# Altium project Power Distribution Board.PrjPcb (part 1 of 2)
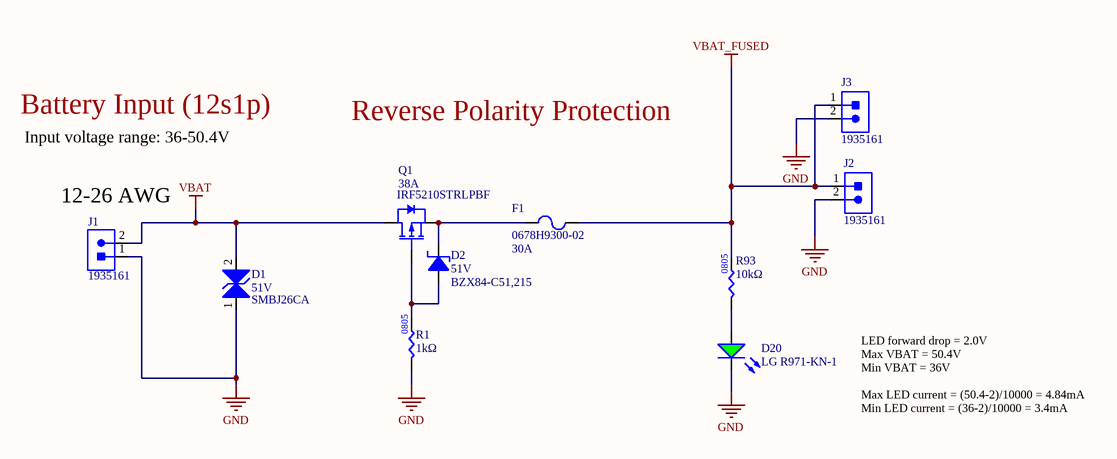
[diagram p0: SH1 - POWER.SchDoc]
9 sheets, 192 parts. Net scope: flat (ports and power ports of the same name join across sheets).
Board file: Power Distribution Board.PcbDoc
Sheets:
  SH1 - POWER.SchDoc
  SH2 - 17V BUCK CONVERTER.SchDoc
  SH3 - 5V BUCK CONVERTER.SchDoc
  SH4 - 3.3V LINEAR REGULATOR.SchDoc
  SH5 - LOAD MONITORING 1.SchDoc
  SH6 - LOAD MONITORING 2.SchDoc
  SH7 - MICROCONTROLLER.SchDoc
  SH8 - CAN.SchDoc
  SH9 - RS-485.SchDoc

## Sheet SH1 - POWER.SchDoc: Power
size B; Engineer: Farris Matar; Organization: UW Robotics; Address1: 200 University Avenue; Address2: Waterloo; Address3: Ontario; Address4: Canada N2L 3G6; DocumentNumber: 1; Revision: 3; SheetNumber: 1; SheetTotal: 9

### Parts
D1  Manufacturer Part Number 1: SMBJ26CA  Voltage - Reverse Standoff (Typ): 51V  [TVS_DIODE_BIDIR_SMB]  (hidden comment: TVS_DIODE_BIDIR_51V)
D2  Manufacturer Part Number 1: BZX84-C51,215  Working Voltage: 51V  [SOT23-3]  (hidden comment: DIO_ZENER_51V)
D20  Manufacturer Part Number 1: LG R971-KN-1  [LED_0805_GREEN]  (hidden comment: LED_GREEN)
F1  Manufacturer Part Number 1: 0678H9300-02  Current Rating: 30A  [FUSE_3912]  (hidden comment: FUSE_30A_3912)
J1  CON_2M_TERM  [1935161]  (value not drawn)
J2  CON_2M_TERM  [1935161]  (value not drawn)
J3  CON_2M_TERM  [1935161]  (value not drawn)
Q1  Current - Continous Drain: 38A  Manufacturer Part Number 1: IRF5210STRLPBF  [DPAK254P1524X483-4_3N - new]  (hidden comment: PMOS_100V_38A)
R1  value 1kΩ  [RES0805]  (hidden comment: RES_1kΩ_0805_1%)
R93  value 10kΩ  [RES0805]  (hidden comment: RES_10kΩ_0805_5%)

### Nets
GND: D1.1 D20.2(K) J1.1 J2.2 J3.2 R1.1
VBAT: D1.2 J1.2 Q1.2(Drain)
VBAT_FUSED: F1.2 J2.1 J3.1 R93.2
NetD2_1: D2.1(Anode) Q1.1(Gate) R1.2
NetD2_3: D2.3(Cathode) F1.1 Q1.3(Source)
NetD20_1: D20.1(A) R93.1

### Notes on the sheet
- Battery Input (12s1p)
- Input voltage range: 36-50.4V
- Reverse Polarity Protection
- (near J1) 12-26 AWG
- LED forward drop = 2.0V
  Max VBAT = 50.4V
  Min VBAT = 36V
  Max LED current = (50.4-2)/10000 = 4.84mA
  Min LED current = (36-2)/10000 = 3.4mA
- Title:
- Project:
- Date:
- Rev:
- Reviewer:
- Engineer:
- Sheet:
- of

### Library data of the parts
D1 = TVS_DIODE_BIDIR_51V: TVS DIODE 51VWM 82.4VC DO214AA; Manufacturer 1: Littelfuse; Package/Footprint: SMB; Voltage - Clamping (Max) @ Ipp: 82.4V; Voltage - Breakdown (Min): 56.7V; Mounting Type: SMD; Supplier 1: Digi-Key; Supplier Part Number 1: SMBJ51CALFCT-ND; Supplier 2: Digi-Key; Supplier Part Number 2: SMBJ51CA-FDIDKR-ND
D2 = DIO_ZENER_51V: DIODE ZENER 51V 250MW TO236AB; Manufacturer 1: Nexperia USA Inc.; Forward Voltage: 0.9V; Supplier Part Number 1: 1727-5037-1-ND; Supplier 1: Digi-Key; Package/Case: SOT-23-3
D20 = LED_GREEN: LED GREEN DIFFUSED 0805 SMD; Manufacturer 1: OSRAM; Forward Voltage Drop: 2.2V; Package/Footprint: 0805; Mounting Type: SMD; Supplier 1: Digi-Key; Supplier Part Number 1: 475-1410-1-ND; Supplier 2: Future Electronics; Supplier Part Number 2: 1152237
F1 = FUSE_30A_3912: FUSE SMT 3912 ENH BRK 250V 30A; Manufacturer 1: Bel Fuse Inc.; Package/Footprint: 3912; Supplier 1: Digi-Key; Supplier Part Number 1: 507-2254-1-ND; Mounting Type: SMD; Verified: No
J1-J3 = CON_2M_TERM: TERM BLK 2POS SIDE ENTRY 5MM; Manufacturer 1: Phoenix Contact; Voltage: 300V; Current: 18A; Max Current Rating: 16A; Package/Footprint: SMD; Supplier 1: Digi-Key; Manufacturer Part Number 1: 1935161; Supplier Part Number 1: 277-1667-ND; Mounting Type: TH
Q1 = PMOS_100V_38A: MOSFET P-CH 100V 38A D2PAK; Manufacturer 1: Vishay Siliconix; Vgs (Max): ±15V; Id: 120A; Mounting Type: SMD; Verified: No; Vdss: 100V; Supplier 1: Digi-Key; Supplier Part Number 1: IRF5210STRLPBFCT-ND; Package/Footprint: D2Pak
R1 = RES_1kΩ_0805_1%: RES 1K OHM 1% 1/8W 0805; Manufacturer 1: Yageo; Manufacturer Part Number 1: RC0805FR-071KL; Package: 0805; Supplier Part Number 1: 311-1.00KCRCT-ND; Supplier 1: Digi-Key; Mounting Type: SMD; LCSC Part #: C17513
R93 = RES_10kΩ_0805_5%: RES 10K OHM 5% 1/8W 0805; Manufacturer 1: Panasonic Electronic Components; Manufacturer Part Number 1: ERJ-6GEYJ103V; Package/Footprint: 0805; Supplier Part Number 1: P10KACT-ND; Supplier 1: Digi-Key; LCSC Part #: C17414; Mounting Type: SMD

## Sheet SH2 - 17V BUCK CONVERTER.SchDoc: 17V Buck Converter
size B; Engineer: Rishith Bomman; Organization: UW Robotics; Address1: 200 University Avenue; Address2: Waterloo; Address3: Ontario; Address4: Canada N2L 3G6; DocumentNumber: 2; Revision: 3; SheetNumber: 2; SheetTotal: 9
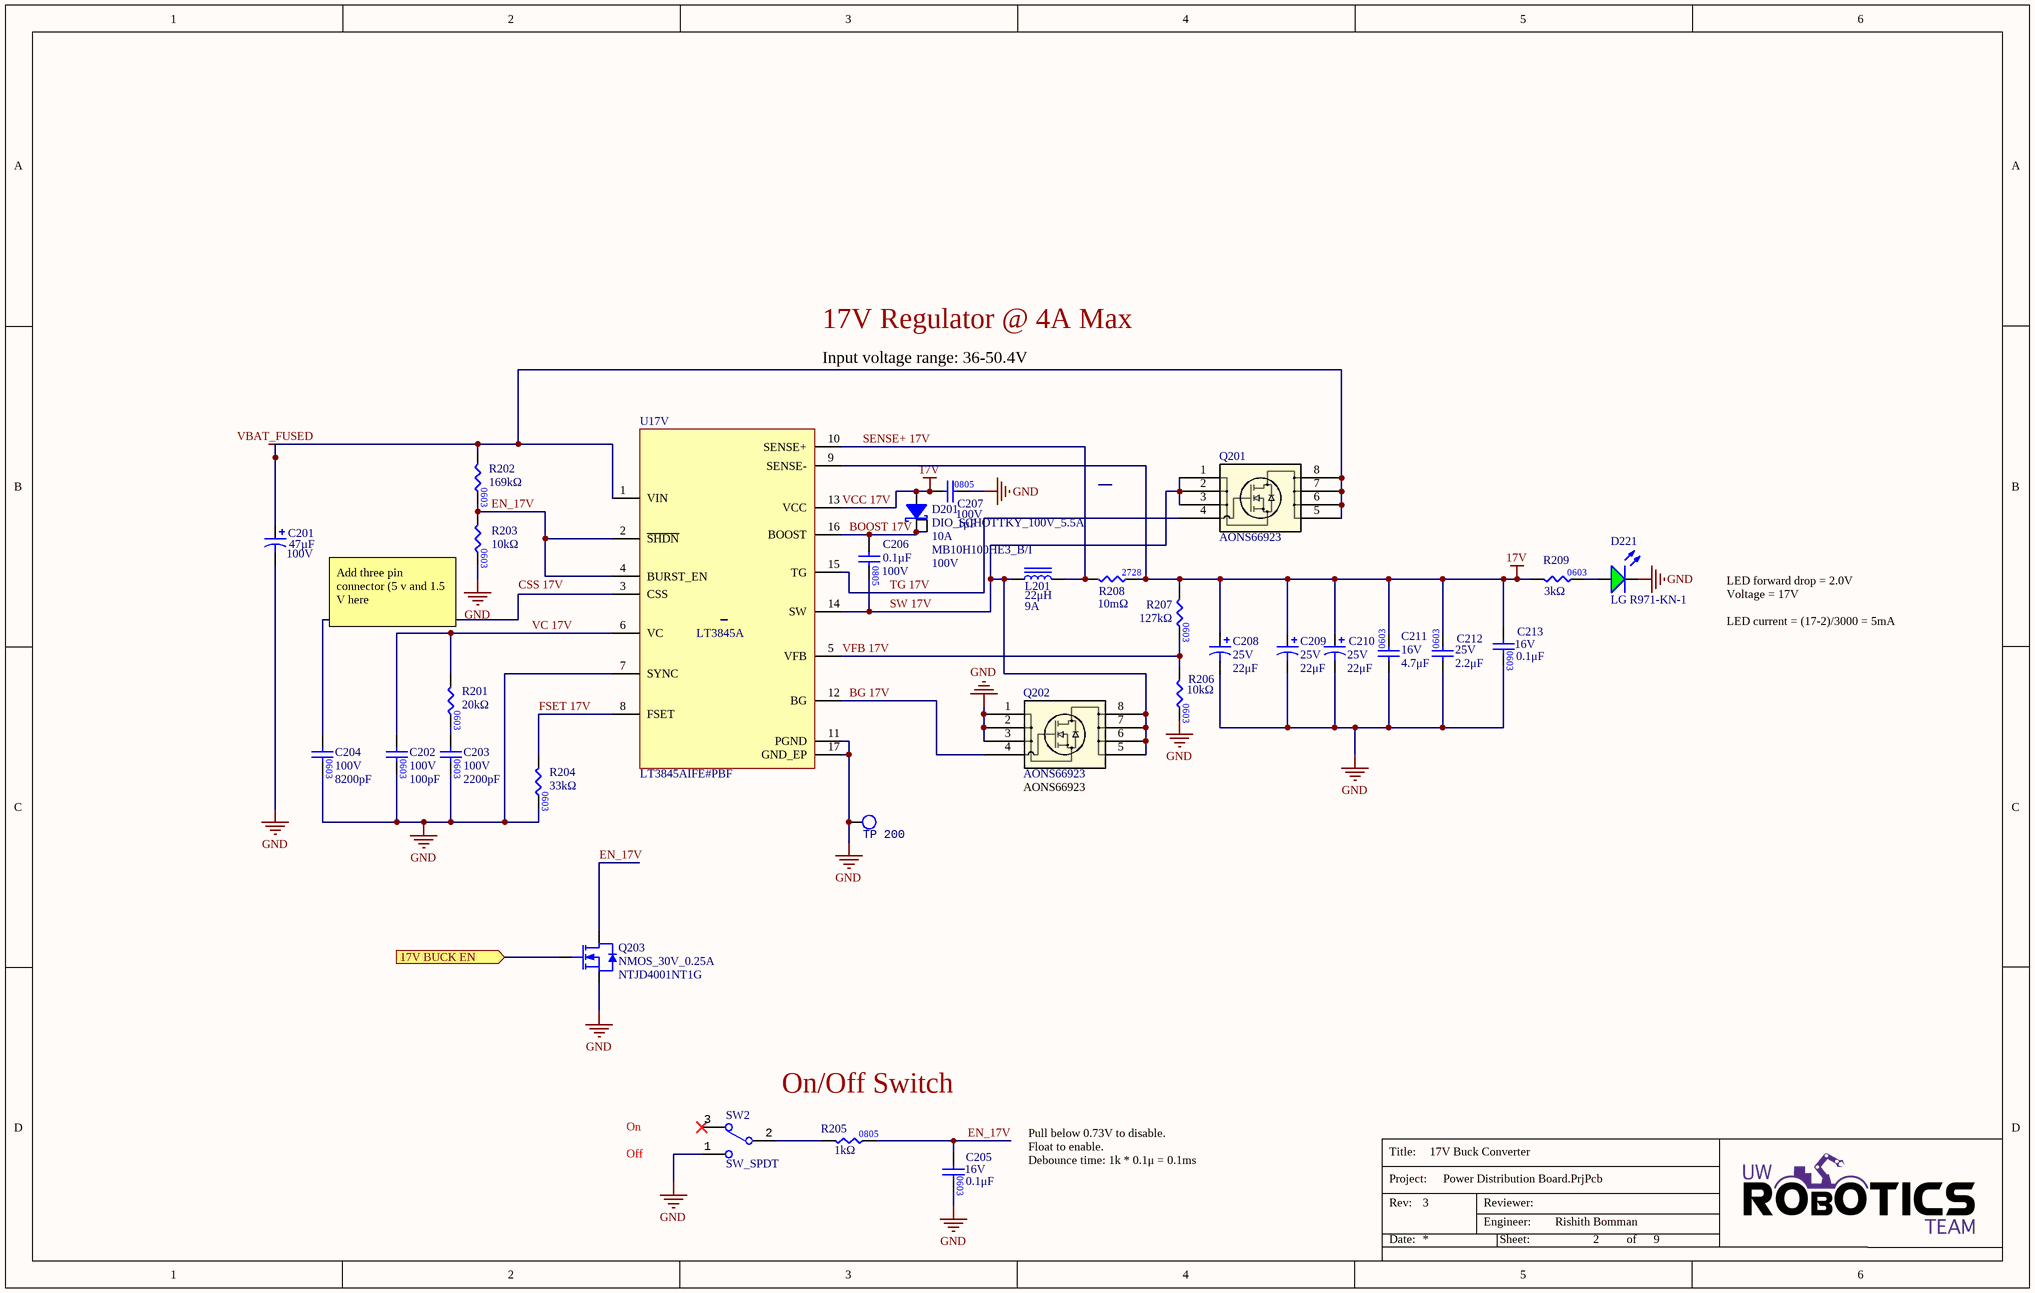
[diagram p1: SH2 - 17V BUCK CONVERTER.SchDoc]

### Parts
C201  value 47µF  Voltage Rating: 100V  [CAP_UCD_10X10_NCH-M]  (hidden comment: CAP_47uF_100V_ALUM_1)
C202  value 100pF  Voltage Rating: 100V  [CAP0603]  (hidden comment: CAP_100pF_100V_0603)
C203  value 2200pF  Voltage Rating: 100V  [CAP0603]  (hidden comment: CAP_2200pF_100V_0603)
C204  value 8200pF  Voltage Rating: 100V  [CAP0603]  (hidden comment: CAP_8200pF_100V_0603)
C205  value 0.1μF  Voltage Rating: 16V  [CAP0603]  (hidden comment: CAP_0.1uF_16V_0603)
C206  value 0.1µF  Voltage Rating: 100V  [CAP0805]  (hidden comment: CAP_0.1uF_100V_0805)
C207  value 1μF  Voltage Rating: 100V  [CAP2012]  (hidden comment: CAP_1uF_100V_0805)
C208  value 22μF  Voltage Rating: 25V  [CAP2917]  (hidden comment: CAP_22uF_25V_TANT)
C209  value 22μF  Voltage Rating: 25V  [CAP2917]  (hidden comment: CAP_22uF_25V_TANT)
C210  value 22μF  Voltage Rating: 25V  [CAP2917]  (hidden comment: CAP_22uF_25V_TANT)
C211  value 4.7μF  Voltage Rating: 16V  [CAP0603]  (hidden comment: CAP_4.7uF_16V_0603)
C212  value 2.2μF  Voltage Rating: 25V  [CAP0603]  (hidden comment: CAP_2.2uF_25V_0603)
C213  value 0.1μF  Voltage Rating: 16V  [CAP0603]  (hidden comment: CAP_0.1uF_16V_0603)
D201  DIO_SCHOTTKY_100V_5.5A  Forward Current: 10A  Manufacturer Part Number 1: MB10H100HE3_B/I  Vr (Max): 100V  [D2PAK (TO-263AB)]
D221  Manufacturer Part Number 1: LG R971-KN-1  [LED_0805_GREEN]  (hidden comment: LED_GREEN)
L201  Current Rating: 9A  Inductance: 22μH  [IND_BOURNS_SRP1265]  (hidden comment: IND_22uH_9A)
Q201  AONS66923  [DFN5X6_8L_EP1_P_AOS-L]
Q202  AONS66923  [DFN5X6_8L_EP1_P_AOS-L]
Q203  NMOS_30V_0.25A  Manufacturer Part Number 1: NTJD4001NT1G  [SOT363]
R201  value 20kΩ  [RES0603]  (hidden comment: RES_20kΩ_0603_1%)
R202  value 169kΩ  [RES0603]  (hidden comment: RES_169kΩ_0603_1%)
R203  value 10kΩ  [RES0603]  (hidden comment: RES_10kΩ_0603_5%)
R204  value 33kΩ  [RES0603]  (hidden comment: RES_33kΩ_0603_5%)
R205  value 1kΩ  [RES0805]  (hidden comment: RES_1kΩ_0805_1%_1)
R206  value 10kΩ  [RES0603]  (hidden comment: RES_10kΩ_0603_5%)
R207  value 127kΩ  [RES0603]  (hidden comment: RES_127kΩ_0603_1%)
R208  value 10mΩ  [STAC-CSS2725-099H_V]  (hidden comment: RES_10mΩ_2728_1%)
R209  value 3kΩ  [RES0603]  (hidden comment: RES_3kΩ_0603_1%)
SW2  SW_SPDT  [100SP1T1B4M2QE]
TP_200  TESTPOINT_LOOP  [TESTPOINT_LOOP]  (value not drawn)
U17V  BUCK_LT3845A  [LT3845AIFE#PBF]  (value not drawn)

### Ports
17V BUCK EN (in)

### Nets
GND: C201.2 C202.2 C203.2 C204.2 C205.2 C207.2 C208.2 C209.2 C210.2 C211.1 C212.1 C213.2 D221.2(K) Q202.1 Q202.2 Q202.3 Q203.2(SOURCE) R203.2 R204.2 R206.2 SW2.1 TP_200.1 U17V.7(SYNC) U17V.11(PGND) U17V.17(GND_EP)
VBAT_FUSED: C201.1 Q201.5 Q201.6 Q201.7 Q201.8 R202.1 U17V.1(VIN)
VCC 17V: C207.1 C208.1 C209.1 C210.1 C211.2 C212.2 C213.1 D201.2(Anode) R207.1 R208.2 R209.1 U17V.9(SENSE-) U17V.13(VCC)  [also labelled 17V]
BG 17V: Q202.4 U17V.12(BG)
BOOST 17V: C206.1 D201.1(Cathode) D201.3(Heatsink_(K)) U17V.16(BOOST)
EN_17V: C205.1 Q203.3(DRAIN) R202.2 R203.1 R205.2 U17V.2(~{SHDN}) U17V.4(BURST_EN)
FSET 17V: R204.1 U17V.8(FSET)
SENSE+ 17V: L201.2 R208.1 U17V.10(SENSE+)
SW 17V: C206.2 L201.1 Q201.1 Q201.2 Q201.3 Q202.5 Q202.6 Q202.7 Q202.8 U17V.14(SW)
TG 17V: Q201.4 U17V.15(TG)
VC 17V: C202.1 R201.1 U17V.6(VC)
VFB 17V: R206.1 R207.2 U17V.5(VFB)
NetC203_1: C203.1 R201.2
NetC204_1: C204.1 U17V.3(CSS)
NetD221_1: D221.1(A) R209.2
NetQ203_1: Q203.1(GATE) ; port 17V BUCK EN
NetR205_1: R205.1 SW2.2

Not connected (* = marked no-connect by the designer): SW2 3*

### Notes on the sheet
- Input voltage range: 36-50.4V
- 17V Regulator @ 4A Max
- (near R203) Add three pin connector (5 v and 1.5 V here
- LED forward drop = 2.0V
  Voltage = 17V
  LED current = (17-2)/3000 = 5mA
- On/Off Switch
- Off
- On
- Pull below 0.73V to disable.
  Float to enable.
  Debounce time: 1k * 0.1μ = 0.1ms
- Labels drawn without touching a wire or pin: CSS 17V
- Title:
- Project:
- Date:
- Rev:
- Reviewer:
- Engineer:
- Sheet:
- of
- (in symbol BUCK_LT3845A) LT3845A
- (in symbol CAP_2.2uF_25V_0603) 0603
- (in symbol CAP_100pF_100V_0603) 0603
- (in symbol CAP_2200pF_100V_0603) 0603
- (in symbol CAP_8200pF_100V_0603) 0603
- (in symbol RES_3kΩ_0603_1%) 0603
- (in symbol RES_10mΩ_2728_1%) 2728
- (in symbol RES_20kΩ_0603_1%) 0603
- (in symbol RES_33kΩ_0603_5%) 0603
- (in symbol RES_127kΩ_0603_1%) 0603
- (in symbol RES_169kΩ_0603_1%) 0603

### Library data of the parts
C201 = CAP_47uF_100V_ALUM_1: CAP ALUM 47UF 20% 100V SMD; Manufacturer 1: Nichicon; Manufacturer Part Number 1: UUR2A470MNL1GS; Mounting Type: SMD; Package/Footprint: SMD; Supplier 1: Digi-Key; Supplier Part Number 1: 493-9589-1-ND
C202 = CAP_100pF_100V_0603: CAP CER 100PF 100V C0G/NP0 0603; Manufacturer Part Number 1: VJ0603A101JXAAC; Manufacturer 1: Vishay Vitramon; Dielectric: C0G, NP0; Supplier 1: Arrow Electronics; Supplier Part Number 1: 06031A101FAT2A
C203 = CAP_2200pF_100V_0603: CAP CER 2200PF 100V X7R 0603; Manufacturer Part Number 1: VJ0603A101JXAAC; Manufacturer 1: Vishay Vitramon; Dielectric: C0G, NP0; Supplier 1: Arrow Electronics; Supplier Part Number 1: 0603B222K101CT
C204 = CAP_8200pF_100V_0603: CAP CER 8200PF 100V X7R 0603; Manufacturer Part Number 1: VJ0603A101JXAAC; Manufacturer 1: Vishay Vitramon; Dielectric: C0G, NP0; Supplier 1: Arrow Electronics; Supplier Part Number 1: 06031C822KAT2A
C205 C213 = CAP_0.1uF_16V_0603: CAP CER 0.1UF 16V X7R 0603; Manufacturer Part Number 1: CC0603KRX7R7BB104; Manufacturer 1: Yageo; Package: 0603; Supplier Part Number 1: 311-1088-1-ND; Supplier 1: Digi-Key; Dielectric: X7R
C206 = CAP_0.1uF_100V_0805: CAP CER 0.1UF 100V X7R 0805; Manufacturer 1: TDK Corporation; Manufacturer Part Number 1: C2012X7R2A104K125AA; Package: 0805; Supplier 1: Digi-Key; Supplier 2: Arrow Electronics; Supplier Part Number 1: 445-1418-1-ND; Supplier Part Number 2: CL21B104KCFNNNE
C207 = CAP_1uF_100V_0805: CAP CER 1UF 100V X7S 0805; Manufacturer Part Number 1: C0805C224K5RACTU; Manufacturer 1: KEMET; Dielectric: X7R; Mounting Type: SMD; Package: 0805; LCSC Part #: C5378; Supplier 1: Newark; Supplier Part Number 1: 79AH1080
C208-C210 = CAP_22uF_25V_TANT: CAP TANT 22UF 20% 25V 2917; Manufacturer Part Number 1: F971A106MBAHT3; Manufacturer 1: AVX Corporation; Supplier 1: Arrow Electronics; Supplier Part Number 1: TPSD226M025R0100
C211 = CAP_4.7uF_16V_0603: CAP CER 4.7UF 16V X6S 0603; Manufacturer Part Number 1: GRM188C81C475KE11D; Manufacturer 1: Murata Electronics; Supplier Part Number 1: 490-13362-1-ND; Supplier 1: Digi-Key; Mounting Type: SMD; Package: 0603; Dielectric: X6S
C212 = CAP_2.2uF_25V_0603: CAP CER 2.2UF 25V X5R 0603; Manufacturer Part Number 1: C1608X5R1E225K080AB; Manufacturer 1: TDK Corporation; Dielectric: 5; Supplier Part Number 1: 445-5964-1-ND; Supplier 1: Digi-Key
D201 = DIO_SCHOTTKY_100V_10A: DIODE SCHOTTKY 100V 10A TO263AB; Manufacturer 1: Vishay General Semiconductor - Diodes Division; Package/Footprint: TO-263AB; Mounting Type: SMD; Supplier 1: Digi-Key; Supplier Part Number 1: 112-MB10H100HE3_B/ICT-ND
D221 = LED_GREEN: as D20 on sheet SH1 - POWER; Mounting Type: SMD; Supplier 1: Digi-Key; Supplier Part Number 1: 475-1410-1-ND; Supplier 2: Future Electronics; Supplier Part Number 2: 1152237
L201 = IND_22uH_9A: 22UH 20%  SMD POWER CHOKE; Manufacturer 1: Bourns Inc.; Manufacturer Part Number 1: SRP1265A-220M; DC Resistance (DCR): 37mOhms; Saturation Current: 12A; Inductance Tolerance: 20%; Mounting Type: SMD; Supplier 1: Arrow Electronics; Supplier Part Number 1: SRP1265A-220M
Q201 Q202 = NMOS_100V_15/47A_1: MOSFET N-CH 100V 15A/47A 8DFN; Mfr_Name: Alpha and Omega Semiconductor; Type: DEV; Copyright: Copyright (C) 2022 Ultra Librarian. All rights reserved.; Digi-Key_Part_Number_1: 785-1815-2-ND; Digi-Key_Part_Number_2: 785-1815-1-ND; Digi-Key_Part_Number_3: 785-1815-6-ND; RefDes: RefDes; Supplier 1: Digi-Key; Supplier Part Number 1: 785-1815-1-ND; Manufacturer_Part_Number: AONS66923
Q203 = NMOS_30V_0.25A: MOSFET 2N-CH 30V 0.25A SOT-363; Manufacturer 1: ON Semiconductor; Supplier 1: Digi-Key; Supplier Part Number 1: NTJD4001NT1GOSCT-ND; DS Breakdown Voltage-Min: 30V
R201 = RES_20kΩ_0603_1%: RES 20K OHM 1% 1/10W 0603; Manufacturer 1: Yageo; Manufacturer Part Number 1: RC0603FR-0720KL; Supplier Part Number 1: 311-20.0KHRCT-ND; Supplier 1: Digi-Key
R202 = RES_169kΩ_0603_1%: RES 169K OHM 1% 1/10W 0603; Manufacturer 1: Yageo; Manufacturer Part Number 1: RC0603FR-07165KL; Supplier 1: Arrow Electronics; Supplier Part Number 1: RMCF0603FT169K
R203 R206 = RES_10kΩ_0603_5%: RES 10K OHM 5% 1/10W 0603; Manufacturer 1: Yageo; Manufacturer Part Number 1: RC0603JR-0710KL; Supplier Part Number 1: 311-10KGRCT-ND; Supplier 1: Digi-Key; Mounting Type: SMD; Package: 0603
R204 = RES_33kΩ_0603_5%: RES 33K OHM 5% 1/10W 0603; Manufacturer 1: Yageo; Manufacturer Part Number 1: RC0603JR-0743KL; Supplier 1: Arrow Electronics; Supplier Part Number 1: CR0603-JW-333ELF
R205 = RES_1kΩ_0805_1%_1: RES 1K OHM 1% 1/8W 0805; Manufacturer 1: Yageo; Manufacturer Part Number 1: RC0805FR-071KL; Supplier Part Number 1: 311-1.00KCRCT-ND; Supplier 1: Digi-Key; LCSC Part #: C17513; Mounting Type: SMD; Package: 0805
R207 = RES_127kΩ_0603_1%: RES 127K OHM 1% 1/10W 0603; Manufacturer 1: Stackpole Electronics Inc; Manufacturer Part Number 1: RMCF0603FT249K; Supplier 1: Arrow Electronics; Supplier Part Number 1: RC0603FR-07127KL
R208 = RES_10mΩ_2728_1%: RES 10mOHM 1% 4W 2728; Manufacturer 1: Yageo; Manufacturer Part Number 1: RC0603FR-07698KL; Supplier Part Number 1: CSSH2728FT10L0DKR-ND; Supplier 1: Digi-Key
R209 = RES_3kΩ_0603_1%: RES 3K OHM 1% 1/10W 0603; Manufacturer 1: Yageo; Manufacturer Part Number 1: RC0603FR-073KL; Supplier 1: Digi-Key; Supplier Part Number 1: 311-3.00KHRCT-ND
SW2 = SW_SPDT: SWITCH TOGGLE SPDT 5A 120V; Manufacturer 1: E-Switch; Voltage Rating (DC): 28V; Package/Footprint: TH; Supplier 1: Digi-Key; Manufacturer Part Number 1: 100SP1T1B4M2QE; Throw Configuration: SPDT; Supplier Part Number 1: EG2355-ND; Current Rating: 5A; Mounting Type: TH
TP_200 = TESTPOINT_LOOP: TESTPOINT THRUHOLE; Manufacturer 1: Keystone Electronics; Manufacturer Part Number 1: 5002; Package/Footprint: TH; Supplier Part Number 1: 36-5002-ND; Supplier 1: Digi-Key; Mounting Type: TH
U17V = BUCK_LT3845A: IC REG CTRLR BUCK 16TSSOP; Manufacturer 1: Analog Devices Inc.; Package/Footprint: 16-TSSOP-EP; Mounting Type: SMD; Supplier 1: Mouser; Supplier Part Number 1: 584-LT3845AIFE#PBF; Manufacturer Part Number 1: LT3845AIFE#PBF

## Sheet SH3 - 5V BUCK CONVERTER.SchDoc: 5V Buck Converter
size B; Engineer: Rishtih Bomman; Organization: UW Robotics; Address1: 200 University Avenue; Address2: Waterloo; Address3: Ontario; Address4: Canada N2L 3G6; DocumentNumber: 3; Revision: 3; SheetNumber: 3; SheetTotal: 9
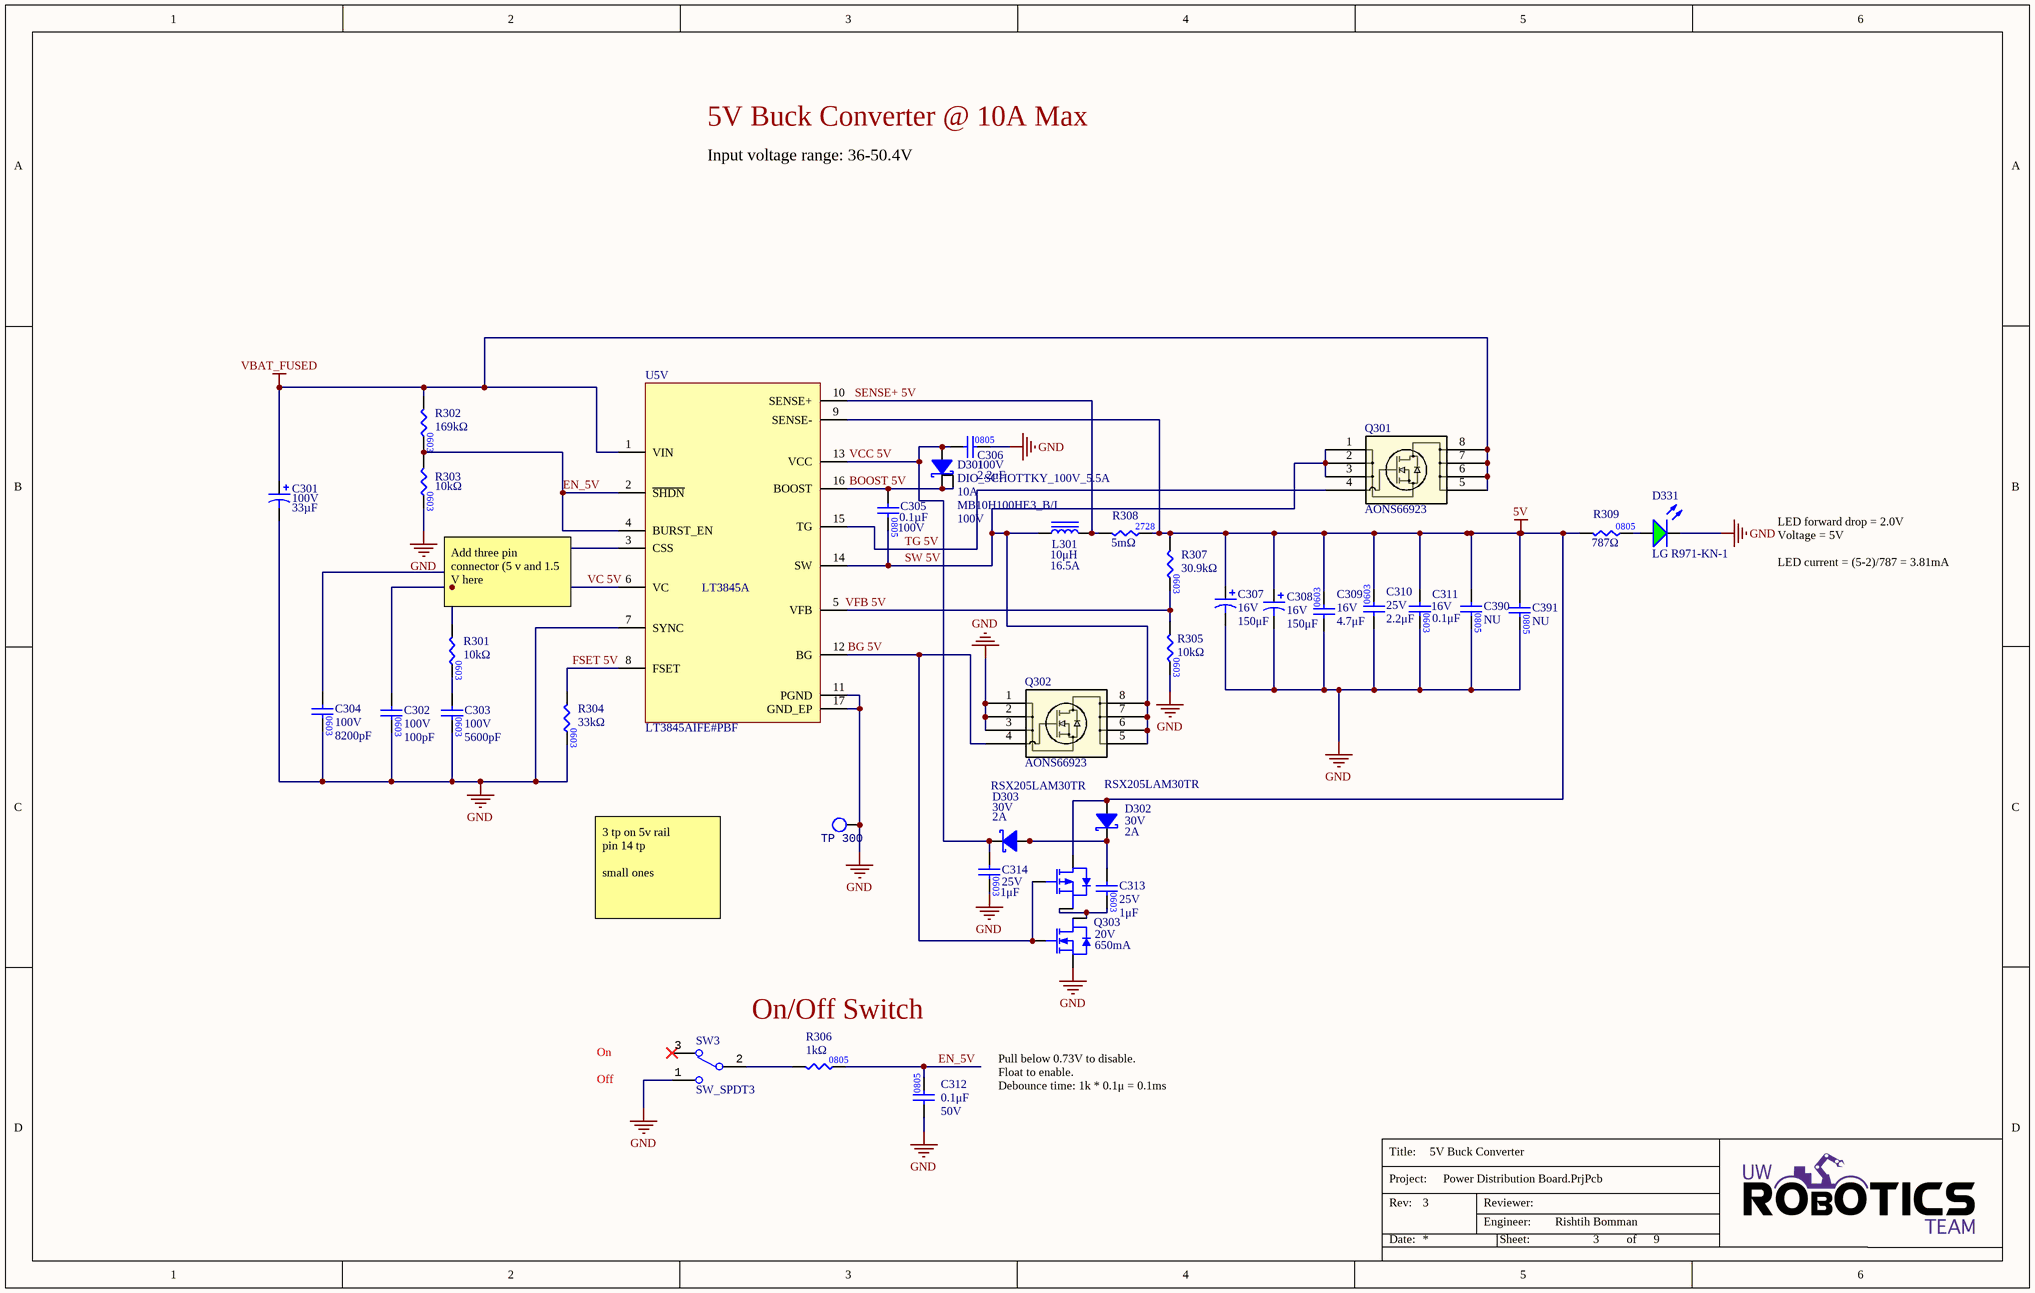
[diagram p2: SH3 - 5V BUCK CONVERTER.SchDoc]

### Parts
C301  value 33µF  Voltage Rating: 100V  [CAP_J-V_8X10P5_RUB-M]  (hidden comment: CAP_33uF_100V_ALUM)
C302  value 100pF  Voltage Rating: 100V  [CAP0603]  (hidden comment: CAP_100pF_100V_0603)
C303  value 5600pF  Voltage Rating: 100V  [CAP0603]  (hidden comment: CAP_5600pF_100V_0603)
C304  value 8200pF  Voltage Rating: 100V  [CAP0603]  (hidden comment: CAP_8200pF_100V_0603)
C305  value 0.1µF  Voltage Rating: 100V  [CAP0805]  (hidden comment: CAP_0.1uF_100V_0805)
C306  value 2.2μF  Voltage Rating: 100V  [CAP2012]  (hidden comment: CAP_2.2uF_100V_0805)
C307  value 150μF  Voltage Rating: 16V  [CAP2917]  (hidden comment: CAP_150uF_16V_TANT_1)
C308  value 150μF  Voltage Rating: 16V  [CAP2917]  (hidden comment: CAP_150uF_16V_TANT_1)
C309  value 4.7μF  Voltage Rating: 16V  [CAP0603]  (hidden comment: CAP_4.7uF_16V_0603)
C310  value 2.2μF  Voltage Rating: 25V  [CAP0603]  (hidden comment: CAP_2.2uF_25V_0603)
C311  value 0.1μF  Voltage Rating: 16V  [CAP0603]  (hidden comment: CAP_0.1uF_16V_0603)
C312  value 0.1μF  Voltage Rating: 50V  [CAP2012]  (hidden comment: CAP_0.1uF_50V_0805)
C313  value 1μF  Voltage Rating: 25V  [CAP0603]  (hidden comment: CAP_1uF_25V_0603)
C314  value 1μF  Voltage Rating: 25V  [CAP0603]  (hidden comment: CAP_1uF_25V_0603)
C390  value NU  [CAP0805]  (hidden comment: CAP_NU_0805)
C391  value NU  [CAP0805]  (hidden comment: CAP_NU_0805)
D301  DIO_SCHOTTKY_100V_5.5A  Forward Current: 10A  Manufacturer Part Number 1: MB10H100HE3_B/I  Vr (Max): 100V  [D2PAK (TO-263AB)]
D302  Manufacturer Part Number 1: RSX205LAM30TR  Vr (Max): 30V  Io: 2A  [SOD-128]  (hidden comment: DIO_SCHOTTKY_30V_2A)
D303  Manufacturer Part Number 1: RSX205LAM30TR  Vr (Max): 30V  Io: 2A  [SOD-128]  (hidden comment: DIO_SCHOTTKY_30V_2A)
D331  Manufacturer Part Number 1: LG R971-KN-1  [LED_0805_GREEN]  (hidden comment: LED_GREEN)
L301  Current Rating: 16.5A  Inductance: 10μH  [IND_MWLA1707S]  (hidden comment: IND_10uH_16.5A)
Q301  AONS66923  [DFN5X6_8L_EP1_P_AOS-L]
Q302  AONS66923  [DFN5X6_8L_EP1_P_AOS-L]
Q303  Continuous Drain Current (ID): 650mA  Drain to Source Voltage (Vdss): 20V  [ES6-M]  (hidden comment: DUAL_MOSFET_20V_650mA_P&N)
R301  value 10kΩ  [RES0603]  (hidden comment: RES_10kΩ_0603_5%)
R302  value 169kΩ  [RES0603]  (hidden comment: RES_169kΩ_0603_1%)
R303  value 10kΩ  [RES0603]  (hidden comment: RES_10kΩ_0603_5%)
R304  value 33kΩ  [RES0603]  (hidden comment: RES_33kΩ_0603_5%)
R305  value 10kΩ  [RES0603]  (hidden comment: RES_10kΩ_0603_5%)
R306  value 1kΩ  [RES0805]  (hidden comment: RES_1kΩ_0805_1%_1)
R307  value 30.9kΩ  [RES0603]  (hidden comment: RES_30.9kΩ_0603_0.5%)
R308  value 5mΩ  [STA_CSSH2728_STP-M]  (hidden comment: RES_5mΩ_2728_1%)
R309  value 787Ω  [RES0805]  (hidden comment: RES_787Ω_0805_1%)
SW3  SW_SPDT3  [100SP1T1B4M2QE]
TP_300  TESTPOINT_LOOP  [TESTPOINT_LOOP]  (value not drawn)
U5V  BUCK_LT3845A  [LT3845AIFE#PBF]  (value not drawn)

### Nets
5V: C307.1 C308.1 C309.2 C310.2 C311.1 C390.1 C391.1 D302.1(Anode) Q303.4(DRAIN-P) R307.1 R308.2 R309.1 U5V.9(SENSE-)
GND: C301.2 C302.2 C303.2 C304.2 C306.2 C307.2 C308.2 C309.1 C310.1 C311.2 C312.1 C314.2 C390.2 C391.2 D331.2(K) Q302.1 Q302.2 Q302.3 Q303.1(SOURCE-N) R303.2 R304.2 R305.2 SW3.1 TP_300.1 U5V.7(SYNC) U5V.11(PGND) U5V.17(GND_EP)
VBAT_FUSED: C301.1 Q301.5 Q301.6 Q301.7 Q301.8 R302.1 U5V.1(VIN)
BG 5V: Q302.4 Q303.2(GATE-N) Q303.5(GATE-P) U5V.12(BG)
BOOST 5V: C305.1 D301.1(Cathode) D301.3(Heatsink_(K)) U5V.16(BOOST)
EN_5V: C312.2 R302.2 R303.1 R306.2 U5V.2(~{SHDN}) U5V.4(BURST_EN)
FSET 5V: R304.1 U5V.8(FSET)
SENSE+ 5V: L301.2 R308.1 U5V.10(SENSE+)
SW 5V: C305.2 L301.1 Q301.1 Q301.2 Q301.3 Q302.5 Q302.6 Q302.7 Q302.8 U5V.14(SW)
TG 5V: Q301.4 U5V.15(TG)
VC 5V: C302.1 R301.1 U5V.6(VC)
VCC 5V: C306.1 C314.1 D301.2(Anode) D303.2(Cathode) U5V.13(VCC)
NetC303_1: C303.1 R301.2
NetC304_1: C304.1 U5V.3(CSS)
NetC313_1: C313.1 D302.2(Cathode) D303.1(Anode)
NetC313_2: C313.2 Q303.3(GATE-N) Q303.6(GATE-N)
NetD331_1: D331.1(A) R309.2
NetR305_1: R305.1 R307.2 U5V.5(VFB)
NetR306_1: R306.1 SW3.2

Not connected (* = marked no-connect by the designer): SW3 3*

### Notes on the sheet
- 5V Buck Converter @ 10A Max
- Input voltage range: 36-50.4V
- Add three pin connector (5 v and 1.5 V here
- LED forward drop = 2.0V
  Voltage = 5V
  LED current = (5-2)/787 = 3.81mA
- 3 tp on 5v rail
  pin 14 tp
  small ones
- On/Off Switch
- Off
- On
- Pull below 0.73V to disable.
  Float to enable.
  Debounce time: 1k * 0.1μ = 0.1ms
- Labels drawn without touching a wire or pin: VFB 5V
- Title:
- Project:
- Date:
- Rev:
- Reviewer:
- Engineer:
- Sheet:
- of
- (in symbol BUCK_LT3845A) LT3845A
- (in symbol CAP_2.2uF_25V_0603) 0603
- (in symbol CAP_100pF_100V_0603) 0603
- (in symbol CAP_5600pF_100V_0603) 0603
- (in symbol CAP_8200pF_100V_0603) 0603
- (in symbol RES_33kΩ_0603_5%) 0603
- (in symbol RES_169kΩ_0603_1%) 0603

### Library data of the parts
C301 = CAP_33uF_100V_ALUM: CAP. ALUM 33UF 100V 20% SMD; Manufacturer 1: RubyCon; Manufacturer Part Number 1: 100SGV33M10X10.5; Mounting Type: SMD; Package/Footprint: SMD; Supplier 1: Digi-Key; Supplier Part Number 1: 1189-2387-1-ND
C302 = CAP_100pF_100V_0603: as C202 on sheet SH2 - 17V BUCK CONVERTER; Supplier 1: Arrow Electronics; Supplier Part Number 1: 06031A101FAT2A
C303 = CAP_5600pF_100V_0603: CAP CER 5600PF 100V X7R 0603; Manufacturer Part Number 1: VJ0603A101JXAAC; Manufacturer 1: Vishay Vitramon; Dielectric: C0G, NP0; Supplier 1: Arrow Electronics; Supplier Part Number 1: 06031C562JAT2A
C304 = CAP_8200pF_100V_0603: as C204 on sheet SH2 - 17V BUCK CONVERTER; Supplier 1: Arrow Electronics; Supplier Part Number 1: 06031C822KAT2A
C305 = CAP_0.1uF_100V_0805: as C206 on sheet SH2 - 17V BUCK CONVERTER; Package: 0805; Supplier 1: Digi-Key; Supplier 2: Arrow Electronics; Supplier Part Number 1: 445-1418-1-ND; Supplier Part Number 2: CL21B104KCFNNNE
C306 = CAP_2.2uF_100V_0805: CAP CER 2.2UF 100V X7T 0805; Manufacturer Part Number 1: C0805C224K5RACTU; Manufacturer 1: KEMET; Dielectric: X7R; Mounting Type: SMD; Package: 0805; LCSC Part #: C5378; Supplier 1: Mouser; Supplier Part Number 1: 81-GRM21BD72A225ME1K
C307 C308 = CAP_150uF_16V_TANT_1: CAP TANT 150UF 10% 16V 2917; Manufacturer Part Number 1: F971A106MBAHT3; Manufacturer 1: AVX Corporation; Supplier 1: Arrow Electronics; Supplier Part Number 1: TPSD157K016R0060
C309 = CAP_4.7uF_16V_0603: as C211 on sheet SH2 - 17V BUCK CONVERTER; Supplier Part Number 1: 490-13362-1-ND; Supplier 1: Digi-Key; Mounting Type: SMD; Package: 0603; Dielectric: X6S
C310 = CAP_2.2uF_25V_0603: as C212 on sheet SH2 - 17V BUCK CONVERTER; Supplier Part Number 1: 445-5964-1-ND; Supplier 1: Digi-Key
C311 = CAP_0.1uF_16V_0603: as C205 on sheet SH2 - 17V BUCK CONVERTER; Package: 0603; Supplier Part Number 1: 311-1088-1-ND; Supplier 1: Digi-Key; Dielectric: X7R
C312 = CAP_0.1uF_50V_0805: CAP CER 0.1UF 50V X7R 0805; Manufacturer Part Number 1: GCM21BR71H104KA37K; Manufacturer 1: Murata Electronics; Package/Footprint: 0805; Supplier Part Number 1: 490-8049-1-ND; Supplier 1: Digi-Key; Dielectric: X7R; LCSC Part #: C49678; Mounting Type: SMD
C313 C314 = CAP_1uF_25V_0603: CAP CER 1UF 25V X5R 0603; Manufacturer 1: Samsung; Manufacturer Part Number 1: CL10A105KA8NNNC; Supplier 1: Digi-Key; Mounting Type: SMD; Package: 0603; Supplier Part Number 1: 1276-1102-1-ND; Dielectric: X5R
C390 C391 = CAP_NU_0805: PLACEHOLDER CAPACITOR; Mounting Type: SMD; Package: 0805
D301 = DIO_SCHOTTKY_100V_10A: as D201 on sheet SH2 - 17V BUCK CONVERTER; Mounting Type: SMD; Supplier 1: Digi-Key; Supplier Part Number 1: 112-MB10H100HE3_B/ICT-ND
D302 D303 = DIO_SCHOTTKY_30V_2A: DIODE SCHOTTKY 30V 2A PMDTM; Manufacturer 1: Rohm Semiconductor; Vf (Max): 490mV; Supplier 1: Digi-Key; Supplier Part Number 1: RSX205LAM30CT-ND; Mounting Type: SMD; Package/Footprint: SOD-128
D331 = LED_GREEN: as D20 on sheet SH1 - POWER; Mounting Type: SMD; Supplier 1: Digi-Key; Supplier Part Number 1: 475-1410-1-ND; Supplier 2: Future Electronics; Supplier Part Number 2: 1152237
L301 = IND_10uH_16.5A: FIXED IND 10UH 13MOHM 24000MA; Manufacturer 1: Shenzhen Sunlord Electronics Co., Ltd.; Manufacturer Part Number 1: MWLA1707S-100MT; DC Resistance (DCR): 13mR; Saturation Current: 24A; Supplier 1: Digi-Key; Supplier Part Number 1: 3442-MWLA1707S-100MTCT-ND
Q301 Q302 = NMOS_100V_15/47A_1: as Q201 on sheet SH2 - 17V BUCK CONVERTER; Copyright: Copyright (C) 2022 Ultra Librarian. All rights reserved.; Digi-Key_Part_Number_1: 785-1815-2-ND; Digi-Key_Part_Number_2: 785-1815-1-ND; Digi-Key_Part_Number_3: 785-1815-6-ND; RefDes: RefDes; Supplier 1: Digi-Key; Supplier Part Number 1: 785-1815-1-ND; Manufacturer_Part_Number: AONS66923
Q303 = DUAL_MOSFET_20V_650mA_P&N: MOSFET N/P-CH 20V 0.65A SOT563; Manufacturer 1: Diodes; Rds On Max: 230mOhms; Input Capacitance: 100pF; Max Power Dissipation: 350mW; Stock 1: 72; Supplier 1: Digi-Key; Supplier Part Number 1: 1514-CMLDM7585TRPBFREECT-ND
R301 R303 R305 = RES_10kΩ_0603_5%: as R203 on sheet SH2 - 17V BUCK CONVERTER; Supplier Part Number 1: 311-10KGRCT-ND; Supplier 1: Digi-Key; Mounting Type: SMD; Package: 0603
R302 = RES_169kΩ_0603_1%: as R202 on sheet SH2 - 17V BUCK CONVERTER; Supplier 1: Arrow Electronics; Supplier Part Number 1: RMCF0603FT169K
R304 = RES_33kΩ_0603_5%: as R204 on sheet SH2 - 17V BUCK CONVERTER; Supplier 1: Arrow Electronics; Supplier Part Number 1: CR0603-JW-333ELF
R306 = RES_1kΩ_0805_1%_1: as R205 on sheet SH2 - 17V BUCK CONVERTER; Supplier Part Number 1: 311-1.00KCRCT-ND; Supplier 1: Digi-Key; LCSC Part #: C17513; Mounting Type: SMD; Package: 0805
R307 = RES_30.9kΩ_0603_0.5%: RES 30.9K OHM 0.5% 1/10W 0603; Manufacturer 1: Yageo; Manufacturer Part Number 1: RT0603DRD0730KL; Package: 0603; Tolerance: 0.5%; Supplier 1: Arrow Electronics; Supplier Part Number 1: RMCF0603FT30K9
R308 = RES_5mΩ_2728_1%: RES 0.005 OHM 1% 4W 2827; Manufacturer 1: Stackpole Electronics Inc; Manufacturer Part Number 1: CSSH2728FT5L00; Package/Footprint: 2728; Mounting Type: SMD; Supplier 1: Digi-Key; Supplier Part Number 1: CSSH2728FT5L00CT-ND
R309 = RES_787Ω_0805_1%: RES 787 OHM 1% 1/8W 0805; Manufacturer 1: Yageo; Manufacturer Part Number 1: RC0805FR-07787RL; Package/Footprint: 0805; Mounting Type: SMD; Supplier 1: Digi-Key; Supplier Part Number 1: RHM.005APCT-ND
SW3 = SW_SPDT: as SW2 on sheet SH2 - 17V BUCK CONVERTER; Supplier 1: Digi-Key; Manufacturer Part Number 1: 100SP1T1B4M2QE; Throw Configuration: SPDT; Supplier Part Number 1: EG2355-ND; Current Rating: 5A; Mounting Type: TH
TP_300 = TESTPOINT_LOOP: as TP_200 on sheet SH2 - 17V BUCK CONVERTER; Supplier Part Number 1: 36-5002-ND; Supplier 1: Digi-Key; Mounting Type: TH
U5V = BUCK_LT3845A: as U17V on sheet SH2 - 17V BUCK CONVERTER; Mounting Type: SMD; Supplier 1: Mouser; Supplier Part Number 1: 584-LT3845AIFE#PBF; Manufacturer Part Number 1: LT3845AIFE#PBF

## Sheet SH4 - 3.3V LINEAR REGULATOR.SchDoc: 3.3V Linear Regulator
size B; CheckedBy: Cindy Li; Engineer: Farris Matar; Organization: UW Robotics; Address1: 200 University Avenue; Address2: Waterloo; Address3: Ontario; Address4: Canada N2L 3G6; DocumentNumber: 4; Revision: 3; SheetNumber: 4; SheetTotal: 9
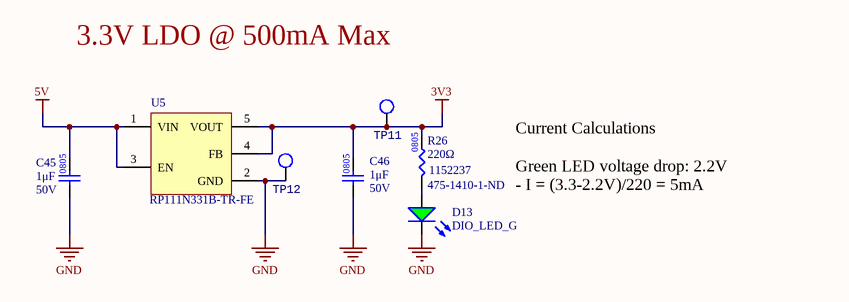
[diagram p3: SH4 - 3.3V LINEAR REGULATOR.SchDoc]

### Parts
C45  value 1μF  Voltage Rating: 50V  [CAP2012]  (hidden comment: CAP_1uF_50V_0805)
C46  value 1μF  Voltage Rating: 50V  [CAP2012]  (hidden comment: CAP_1uF_50V_0805)
D13  DIO_LED_G  Supplier Part Number 1: 475-1410-1-ND  Supplier Part Number 2: 1152237  [LED_0805_GREEN]
R26  value 220Ω  [RES0805]  (hidden comment: RES_220Ω_0805_5%)
TP11  TESTPOINT_LOOP  [TESTPOINT_LOOP]  (value not drawn)
TP12  TESTPOINT_LOOP  [TESTPOINT_LOOP]  (value not drawn)
U5  Manufacturer Part Number 1: RP111N331B-TR-FE  [SOT23-5]  (hidden comment: LDO_3.3V_500mA)

### Nets
3V3: C46.2 R26.2 TP11.1 U5.4(FB) U5.5(VOUT)
5V: C45.2 U5.1(VIN) U5.3(EN)
GND: C45.1 C46.1 D13.2(K) TP12.1 U5.2(GND)
NetD13_1: D13.1(A) R26.1

### Notes on the sheet
- 3.3V LDO @ 500mA Max
- Current Calculations
  Green LED voltage drop: 2.2V
  - I = (3.3-2.2V)/220 = 5mA
- Title:
- Project:
- Date:
- Rev:
- Reviewer:
- Engineer:
- Sheet:
- of

### Library data of the parts
C45 C46 = CAP_1uF_50V_0805: CAP CER 1UF 50V X7R 0805; Manufacturer 1: Samsung Electro-Mechanics; Manufacturer Part Number 1: CL21B105KBFNNNG; Supplier Part Number 1: 1276-6470-1-ND; Supplier 1: Digi-Key; LCSC Part #: C28323; Mounting Type: SMD; Package: 0805
D13 = DIO_LED_G: LED GREEN DIFFUSED 0805 SMD; Manufacturer Part Number 1: LG R971-KN-1; Manufacturer 1: OSRAM; Forward Voltage Drop: 2.2V; Package/Footprint: 0805; Mounting Type: SMD; Supplier 1: Digi-Key; Supplier 2: Future Electronics
R26 = RES_220Ω_0805_5%: RES 220 OHM 5% 1/2W 0805; Manufacturer 1: Panasonic Electronic Components; Manufacturer Part Number 1: ERJ-P06J221V; Supplier Part Number 1: P220ADCT-ND; Supplier 1: Digi-Key; LCSC Part #: C17557; Mounting Type: SMD; Package: 0805
TP11 TP12 = TESTPOINT_LOOP: as TP_200 on sheet SH2 - 17V BUCK CONVERTER; Supplier 1: Digi-Key; Supplier Part Number 1: 36-5002-ND; Mounting Type: TH
U5 = LDO_3.3V_500mA: IC REG LINEAR 3.3V 500MA SOT23-5; Manufacturer 1: RICOH Electronic Devices Co., LTD.; Input Voltage (Max): 5.25V; Voltage Dropout (Max): 0.32V; Package/Footprint: SOT-25; Supplier 1: Digi-Key; Supplier Part Number 1: 2129-RP111N331B-TR-FECT-ND; Output Voltage (Fixed): 3.3V; Output Current: 500mA; Operating Temperature: -40°C - 85°C; Mounting Type: SMD

## Sheet SH5 - LOAD MONITORING 1.SchDoc: Load Monitoring 1
size B; CheckedBy: Cindy Li; Engineer: Farris Matar; Organization: UW Robotics; Address1: 200 University Avenue; Address2: Waterloo; Address3: Ontario; Address4: Canada N2L 3G6; DocumentNumber: 5; Revision: 3; SheetNumber: 5; SheetTotal: 9
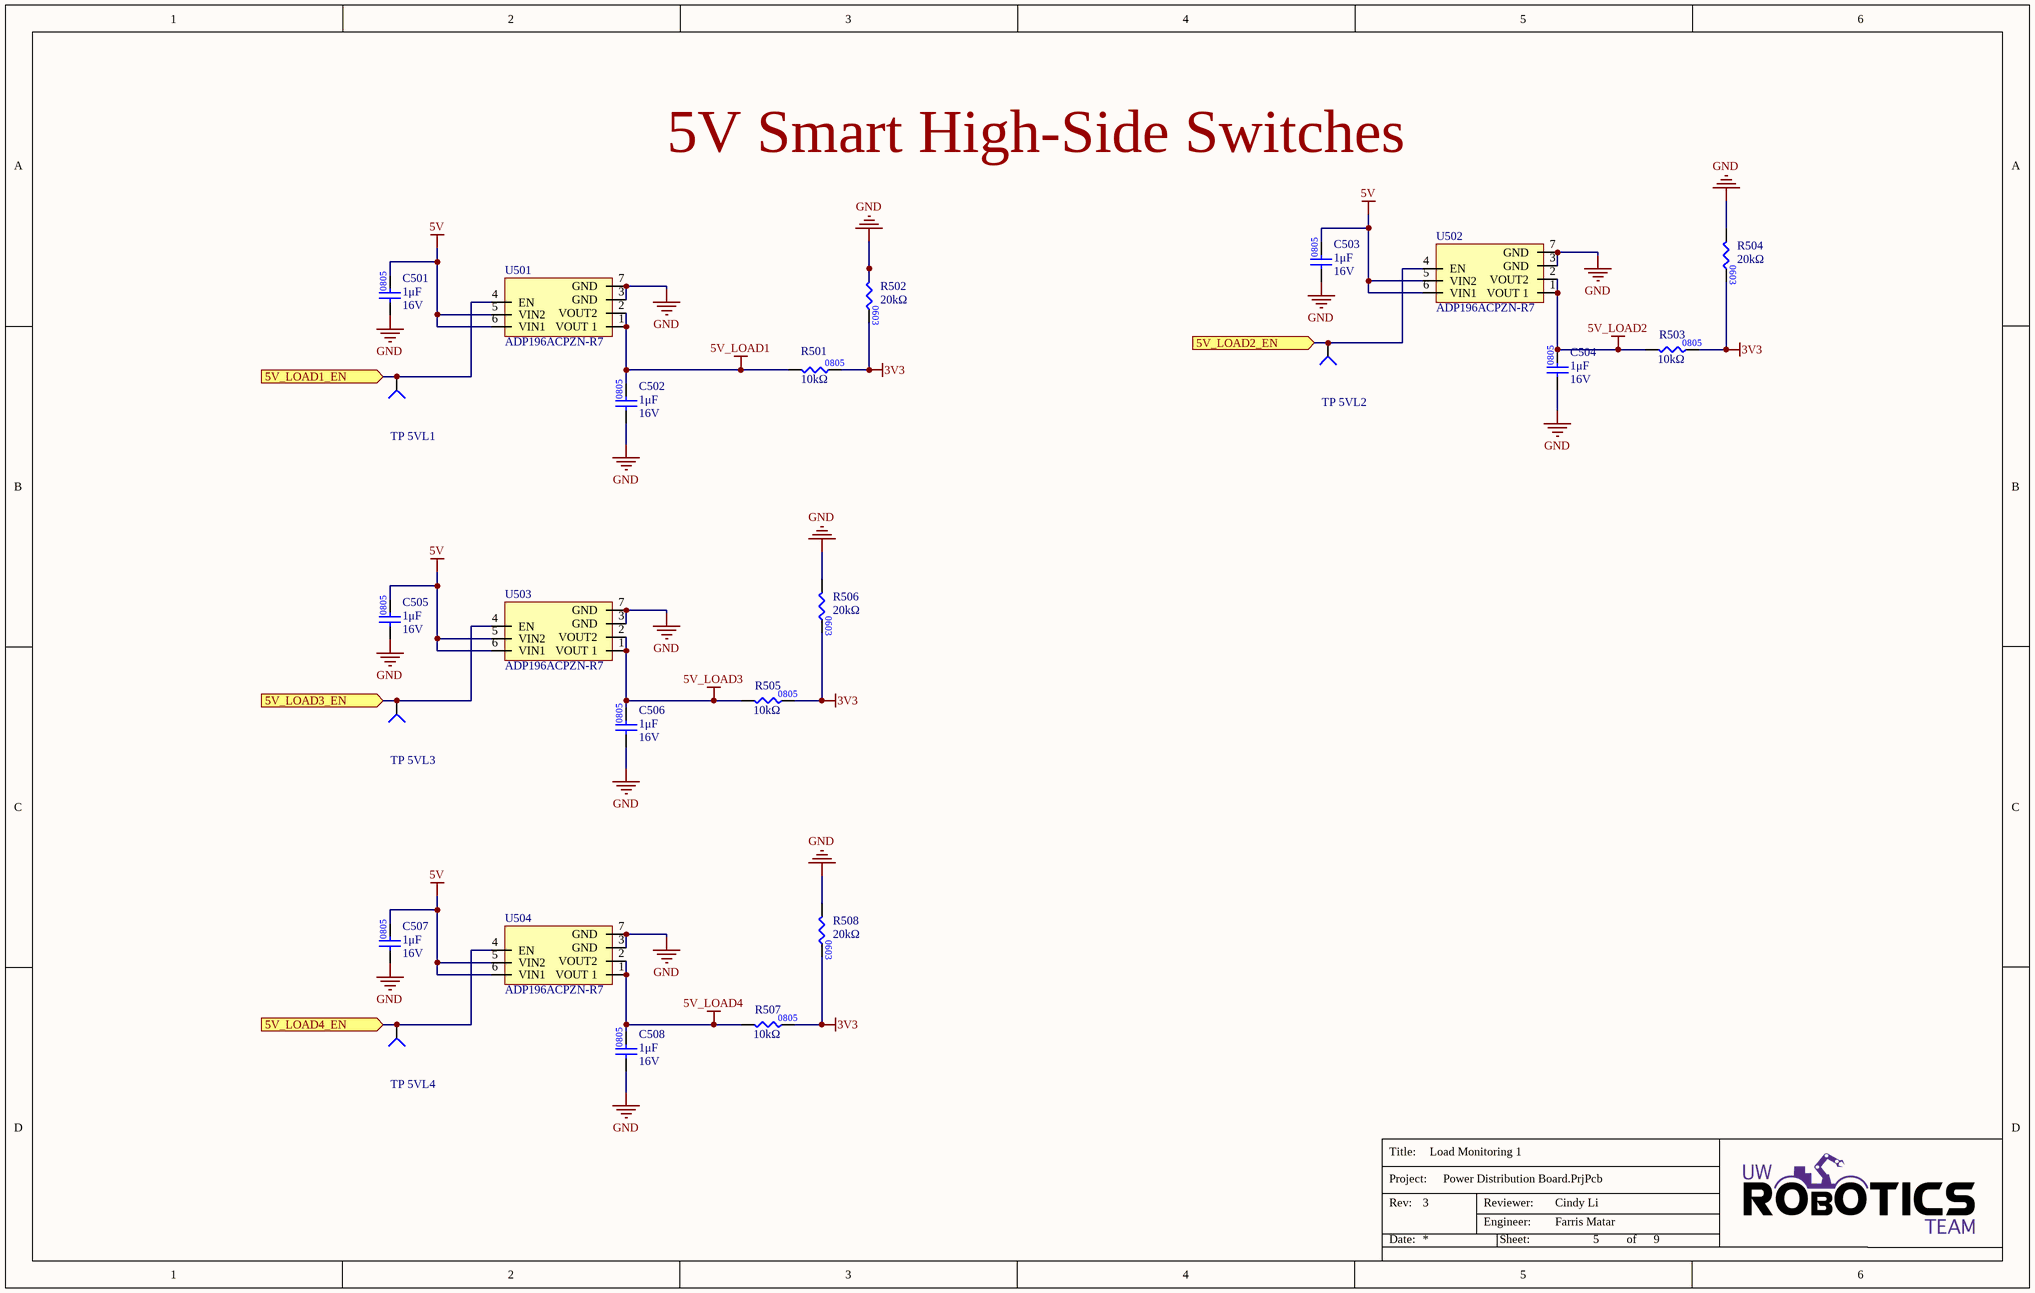
[diagram p4: SH5 - LOAD MONITORING 1.SchDoc]

### Parts
C501  value 1μF  Voltage Rating: 16V  [CAP0805]  (hidden comment: CAP_1uF_16V_0805)
C502  value 1μF  Voltage Rating: 16V  [CAP0805]  (hidden comment: CAP_1uF_16V_0805)
C503  value 1μF  Voltage Rating: 16V  [CAP0805]  (hidden comment: CAP_1uF_16V_0805)
C504  value 1μF  Voltage Rating: 16V  [CAP0805]  (hidden comment: CAP_1uF_16V_0805)
C505  value 1μF  Voltage Rating: 16V  [CAP0805]  (hidden comment: CAP_1uF_16V_0805)
C506  value 1μF  Voltage Rating: 16V  [CAP0805]  (hidden comment: CAP_1uF_16V_0805)
C507  value 1μF  Voltage Rating: 16V  [CAP0805]  (hidden comment: CAP_1uF_16V_0805)
C508  value 1μF  Voltage Rating: 16V  [CAP0805]  (hidden comment: CAP_1uF_16V_0805)
R501  value 10kΩ  [RES0805]  (hidden comment: RES_10kΩ_0805_5%)
R502  value 20kΩ  [RES0603]  (hidden comment: RES_20kΩ_0603_1%)
R503  value 10kΩ  [RES0805]  (hidden comment: RES_10kΩ_0805_5%)
R504  value 20kΩ  [RES0603]  (hidden comment: RES_20kΩ_0603_1%)
R505  value 10kΩ  [RES0805]  (hidden comment: RES_10kΩ_0805_5%)
R506  value 20kΩ  [RES0603]  (hidden comment: RES_20kΩ_0603_1%)
R507  value 10kΩ  [RES0805]  (hidden comment: RES_10kΩ_0805_5%)
R508  value 20kΩ  [RES0603]  (hidden comment: RES_20kΩ_0603_1%)
TP_5VL1  TESTPOINT_1MM_CIRCLE  [TESTPOINT_CIRCLE_1MM]  (value not drawn)  (no BOM)
TP_5VL2  TESTPOINT_1MM_CIRCLE  [TESTPOINT_CIRCLE_1MM]  (value not drawn)  (no BOM)
TP_5VL3  TESTPOINT_1MM_CIRCLE  [TESTPOINT_CIRCLE_1MM]  (value not drawn)  (no BOM)
TP_5VL4  TESTPOINT_1MM_CIRCLE  [TESTPOINT_CIRCLE_1MM]  (value not drawn)  (no BOM)
U501  Supplier Part Number 1: ADP196ACPZN-R7  [CP_6_3_ADI-M]  (hidden comment: IC_PWR_SWTICH_5V)
U502  Supplier Part Number 1: ADP196ACPZN-R7  [CP_6_3_ADI-M]  (hidden comment: IC_PWR_SWTICH_5V)
U503  Supplier Part Number 1: ADP196ACPZN-R7  [CP_6_3_ADI-M]  (hidden comment: IC_PWR_SWTICH_5V)
U504  Supplier Part Number 1: ADP196ACPZN-R7  [CP_6_3_ADI-M]  (hidden comment: IC_PWR_SWTICH_5V)

### Ports
5V_LOAD1_EN (in), 5V_LOAD2_EN (in), 5V_LOAD3_EN (in), 5V_LOAD4_EN (in)

### Nets
3V3: R501.2 R502.2 R503.2 R504.2 R505.2 R506.2 R507.2 R508.2
5V: C501.2 C503.2 C505.2 C507.2 U501.5(VIN2) U501.6(VIN1) U502.5(VIN2) U502.6(VIN1) U503.5(VIN2) U503.6(VIN1) U504.5(VIN2) U504.6(VIN1)
5V_LOAD1: C502.2 R501.1 U501.1(VOUT_1) U501.2(VOUT2)
5V_LOAD2: C504.2 R503.1 U502.1(VOUT_1) U502.2(VOUT2)
5V_LOAD3: C506.2 R505.1 U503.1(VOUT_1) U503.2(VOUT2)
5V_LOAD4: C508.2 R507.1 U504.1(VOUT_1) U504.2(VOUT2)
GND: C501.1 C502.1 C503.1 C504.1 C505.1 C506.1 C507.1 C508.1 R502.1 R504.1 R506.1 R508.1 U501.3(GND) U501.7(GND) U502.3(GND) U502.7(GND) U503.3(GND) U503.7(GND) U504.3(GND) U504.7(GND)
NetTP_5VL1_1: TP_5VL1.1(=value) U501.4(EN) ; port 5V_LOAD1_EN
NetTP_5VL2_1: TP_5VL2.1(=value) U502.4(EN) ; port 5V_LOAD2_EN
NetTP_5VL3_1: TP_5VL3.1(=value) U503.4(EN) ; port 5V_LOAD3_EN
NetTP_5VL4_1: TP_5VL4.1(=value) U504.4(EN) ; port 5V_LOAD4_EN

### Notes on the sheet
- 5V Smart High-Side Switches
- Title:
- Project:
- Date:
- Rev:
- Reviewer:
- Engineer:
- Sheet:
- of
- (in symbol RES_20kΩ_0603_1%) 0603

### Library data of the parts
C501-C508 = CAP_1uF_16V_0805: CAP CER 1UF 16V X7R 0805; Manufacturer 1: Yageo; Manufacturer Part Number 1: CC0805KKX7R7BB105; Mounting Type: SMD; Supplier 1: Digi-Key; Supplier Part Number 1: 311-1365-1-ND; Package: 0805; Dielectric: X7R
R501 R503 R505 R507 = RES_10kΩ_0805_5%: as R93 on sheet SH1 - POWER; Supplier 1: Digi-Key; Supplier Part Number 1: P10KACT-ND; LCSC Part #: C17414; Mounting Type: SMD
R502 R504 R506 R508 = RES_20kΩ_0603_1%: as R201 on sheet SH2 - 17V BUCK CONVERTER; Supplier Part Number 1: 311-20.0KHRCT-ND; Supplier 1: Digi-Key
TP_5VL1-TP_5VL4 = TESTPOINT_1MM_CIRCLE: TESTPOINT 1MM CIRCLE
U501-U504 = IC_PWR_SWTICH_5V: IC PWR SWITCH N-CHAN 1:1 6LFCSP; Manufacturer 1: Analog Devices Inc.; Package/Footprint: 6-UDFN Exposed Pad, CSP; Manufacturer Part Number 1: ADP196ACPZN-R7; Mounting Type: SMD; Supplier 1: Arrow Electronics

## Sheet SH6 - LOAD MONITORING 2.SchDoc: Load Monitoring 2
size B; DrawnBy: Farris Matar; Engineer: Farris Matar; Organization: UW Robotics; Address1: 200 University Avenue; Address2: Waterloo; Address3: Ontario; Address4: Canada N2L 3G6; DocumentNumber: 6; Revision: 3; SheetNumber: 6; SheetTotal: 9
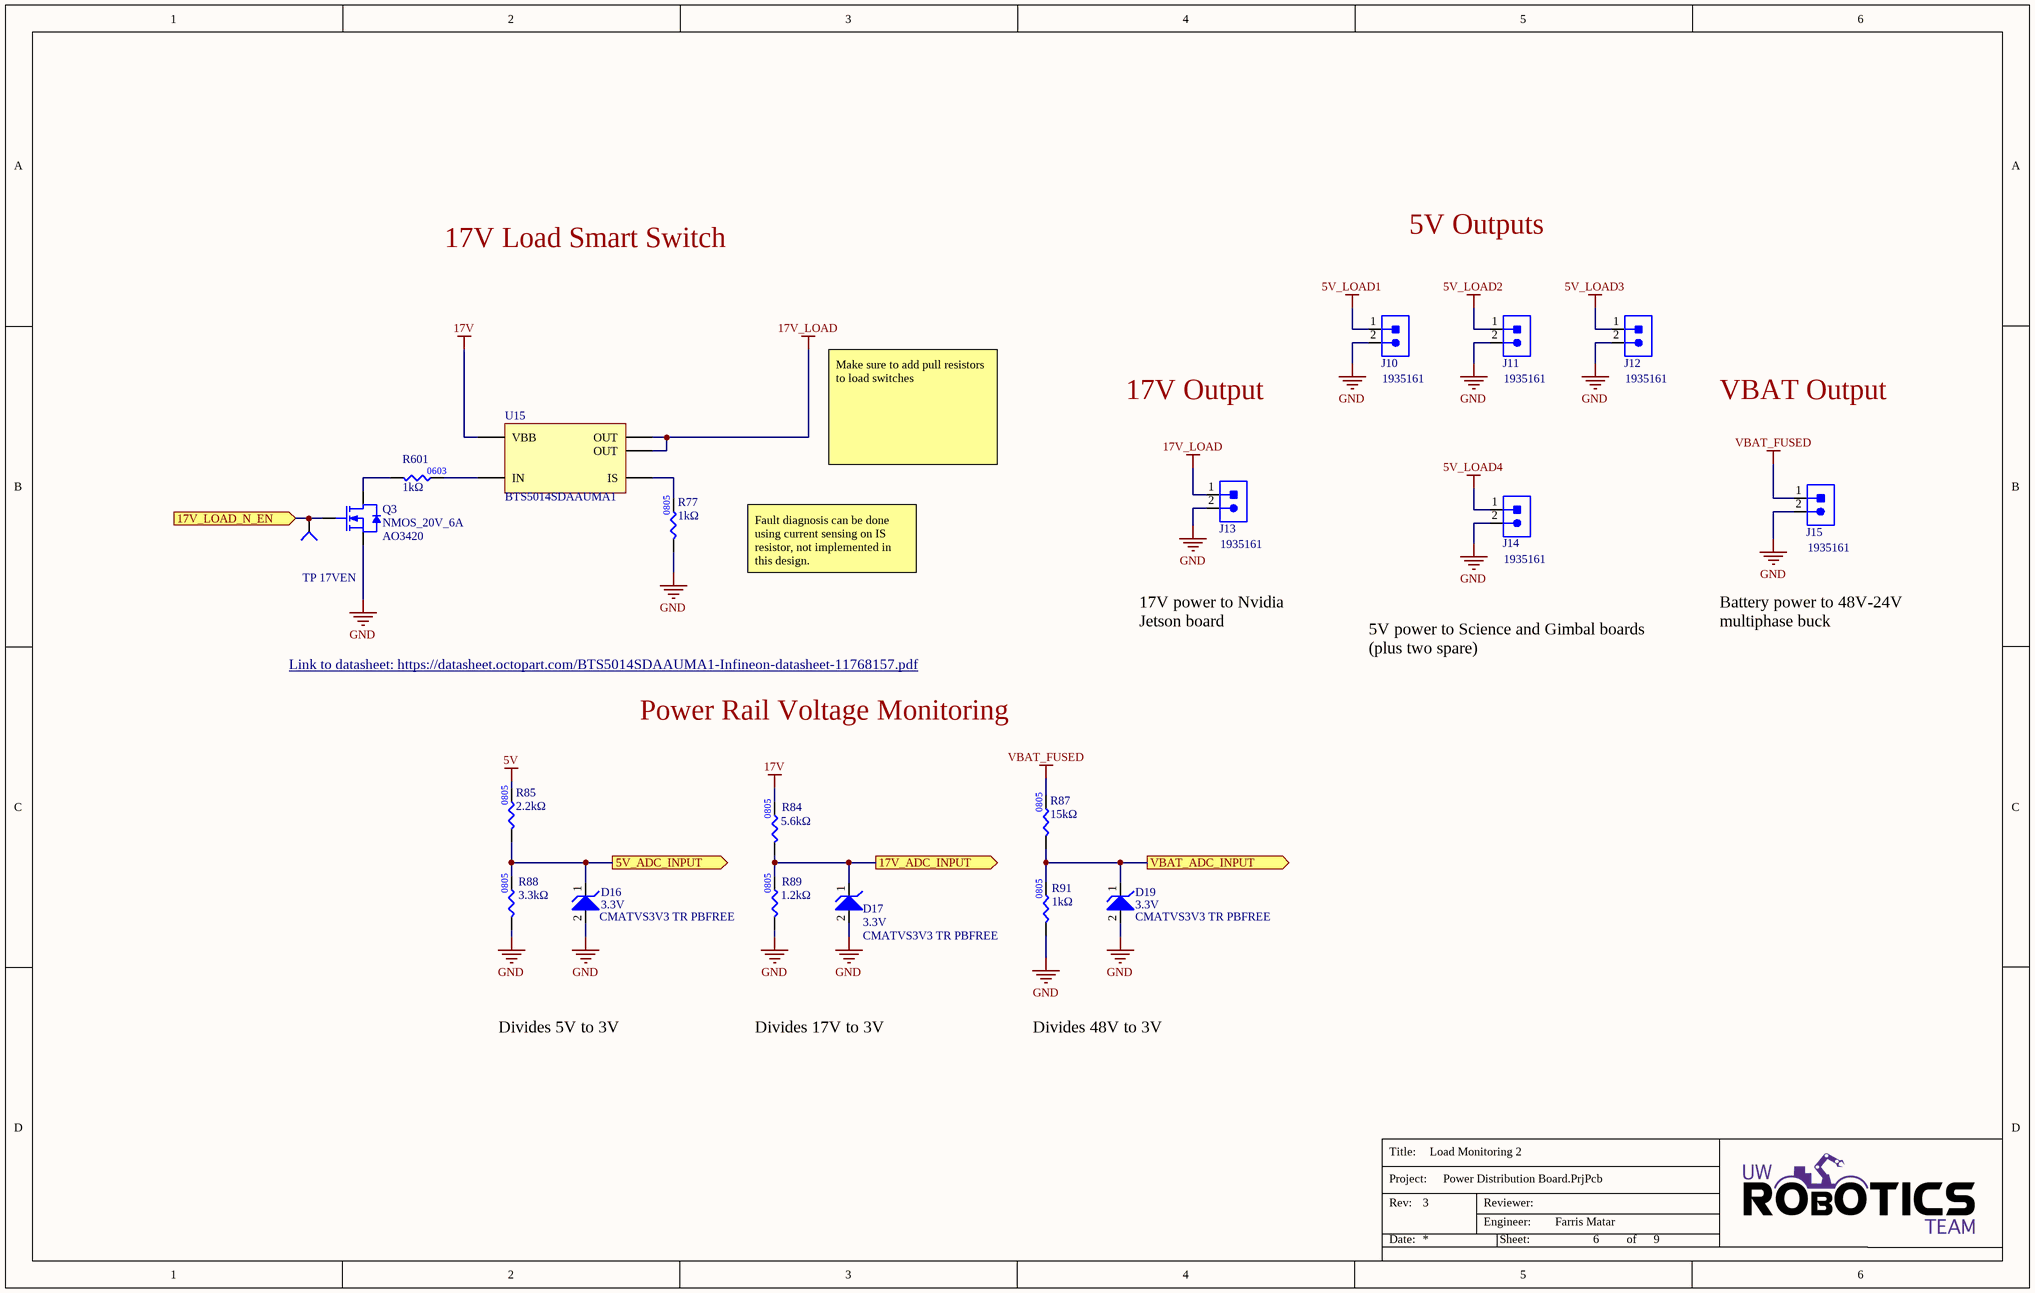
[diagram p5: SH6 - LOAD MONITORING 2.SchDoc]

### Parts
D16  Manufacturer Part Number 1: CMATVS3V3 TR PBFREE  Voltage - Reverse Standoff (Typ): 3.3V  [SOD-923]  (hidden comment: TVS_DIODE_UNIDIR_3.3V_7A)
D17  Manufacturer Part Number 1: CMATVS3V3 TR PBFREE  Voltage - Reverse Standoff (Typ): 3.3V  [SOD-923]  (hidden comment: TVS_DIODE_UNIDIR_3.3V_7A)
D19  Manufacturer Part Number 1: CMATVS3V3 TR PBFREE  Voltage - Reverse Standoff (Typ): 3.3V  [SOD-923]  (hidden comment: TVS_DIODE_UNIDIR_3.3V_7A)
J10  CON_2M_TERM  [1935161]  (value not drawn)
J11  CON_2M_TERM  [1935161]  (value not drawn)
J12  CON_2M_TERM  [1935161]  (value not drawn)
J13  CON_2M_TERM  [1935161]  (value not drawn)
J14  CON_2M_TERM  [1935161]  (value not drawn)
J15  CON_2M_TERM  [1935161]  (value not drawn)
Q3  NMOS_20V_6A  Manufacturer Part Number 1: AO3420  [SOT23-3]
R77  value 1kΩ  [RES0805]  (hidden comment: RES_1kΩ_0805_1%)
R84  value 5.6kΩ  [RES0805]  (hidden comment: RES_5.6kΩ_0805)
R85  value 2.2kΩ  [RES0805]  (hidden comment: RES_2.2kΩ_0805)
R87  value 15kΩ  [RES0805]  (hidden comment: RES_15kΩ_0805_1%)
R88  value 3.3kΩ  [RES0805]  (hidden comment: RES_3.3kΩ_0805_1%)
R89  value 1.2kΩ  [RES0805]  (hidden comment: RES_1.2kΩ_0805)
R91  value 1kΩ  [RES0805]  (hidden comment: RES_1kΩ_0805_1%_1)
R601  value 1kΩ  [RES0603]  (hidden comment: RES_1kΩ_0603_5%)
TP_17VEN  TESTPOINT_1MM_CIRCLE  [TESTPOINT_CIRCLE_1MM]  (value not drawn)  (no BOM)
U15  BTS5014SDAAUMA1  [D2PAK-4]

### Ports
5V_ADC_INPUT (out), 17V_ADC_INPUT (out), 17V_LOAD_N_EN (in), VBAT_ADC_INPUT (out)

### Nets
5V: R85.2
5V_LOAD1: J10.1
5V_LOAD2: J11.1
5V_LOAD3: J12.1
5V_LOAD4: J14.1
17V: R84.2 U15.3(VBB)  [project net VCC 17V]
17V_LOAD: J13.1 U15.1(OUT) U15.5(OUT)
GND: D16.2 D17.2 D19.2 J10.2 J11.2 J12.2 J13.2 J14.2 J15.2 Q3.2(SOURCE) R77.1 R88.1 R89.1 R91.1
VBAT_FUSED: J15.1 R87.2
NetD16_1: D16.1 R85.1 R88.2 ; port 5V_ADC_INPUT
NetD17_1: D17.1 R84.1 R89.2 ; port 17V_ADC_INPUT
NetD19_1: D19.1 R87.1 R91.2 ; port VBAT_ADC_INPUT
NetQ3_1: Q3.1(GATE) TP_17VEN.1(=value) ; port 17V_LOAD_N_EN
NetQ3_3: Q3.3(DRAIN) R601.1
NetR77_2: R77.2 U15.4(IS)
NetR601_2: R601.2 U15.2(IN)

### Notes on the sheet
- 5V Outputs
- 17V Load Smart Switch
- 17V Output
- VBAT Output
- Make sure to add pull resistors to load switches
- Fault diagnosis can be done using current sensing on IS resistor, not implemented in this design.
- 17V power to Nvidia Jetson board
- Battery power to 48V-24V multiphase buck
- Link to datasheet: https://datasheet.octopart.com/BTS5014SDAAUMA1-Infineon-datasheet-11768157.pdf <https://datasheet.octopart.com/BTS5014SDAAUMA1-Infineon-datasheet-11768157.pdf>
- 5V power to Science and Gimbal boards (plus two spare)
- Power Rail Voltage Monitoring
- Divides 5V to 3V
- Divides 17V to 3V
- Divides 48V to 3V
- Title:
- Project:
- Date:
- Rev:
- Reviewer:
- Engineer:
- Sheet:
- of
- (in symbol RES_15kΩ_0805_1%) 0805

### Library data of the parts
D16 D17 D19 = TVS_DIODE_UNIDIR_3.3V_7A: TVS DIODE 3.3VWM 11VC SOD923; Manufacturer 1: Central Semiconductor Corp; Voltage - Breakdown (Min): 5V; Voltage - Clamping (Max) @ Ipp: 11V; Mounting Type: SMD; Package/Footprint: SOD-923; Supplier 1: Digi-Key; Supplier Part Number 1: 1514-CMATVS3V3TRPBFREECT-ND; Supplier 2: Mouser; Supplier Part Number 2: 610-CMATVS3V3
J10-J15 = CON_2M_TERM: TERM BLK 2POS SIDE ENTRY 5MM; Manufacturer 1: Phoenix Contact; Max Current Rating: 16A; Current: 18A; Voltage: 300V; Package/Footprint: SMD; Supplier 1: Digi-Key; Supplier Part Number 1: 277-1667-ND; Manufacturer Part Number 1: 1935161; Mounting Type: TH
Q3 = NMOS_20V_6A: MOSFET N-CH 20V 6A SOT-23; Manufacturer 1: Alpha & Omega; Supplier 1: Digi-Key; Supplier Part Number 1: 785-1014-2-ND
R77 = RES_1kΩ_0805_1%: as R1 on sheet SH1 - POWER; Supplier 1: Digi-Key; Mounting Type: SMD; Supplier Part Number 1: 311-1.00KCRCT-ND; LCSC Part #: C17513; Package: 0805
R84 = RES_5.6kΩ_0805_5%: RES 5.6K OHM 5% 1/8W 0805; Manufacturer 1: Yageo; Manufacturer Part Number 1: RC0805JR-075K6L; Supplier Part Number 1: 311-5.6KARCT-ND; Supplier 1: Digi-Key; Tolerance: 5%; Package: 0805
R85 = RES_2.2kΩ_0805_5%: RES 2.2K OHM 5% 1/8W 0805; Manufacturer 1: Vishay Dale; Manufacturer Part Number 1: CRCW08052K20JNEAC; Supplier Part Number 1: 541-4169-1-ND; Supplier 1: Digi-Key; Tolerance: 5%; Package: 0805
R87 = RES_15kΩ_0805_1%: RES 15K OHM 1% 1/8W 0805 /; Manufacturer 1: Vishay Dale; Manufacturer Part Number 1: CRCW080515K0FKEA; Supplier Part Number 1: 541-15.0KCCT-ND; Supplier 1: Digi-Key
R88 = RES_3.3kΩ_0805_1%: RES 3.3K OHM 1% 1/8W 0805; Manufacturer 1: Vishay Dale; Manufacturer Part Number 1: CRCW06033K30FKEA; Supplier 1: Digi-Key; Supplier Part Number 1: 541-3.30KHCT-ND; LCSC Part #: C26010; Mounting Type: SMD; Package: 0805
R89 = RES_1.2kΩ_0805_5%: RES 1.2K OHM 5% 1/8W 0805; Manufacturer 1: Yageo; Manufacturer Part Number 1: RC0805JR-071K2L; Supplier 1: Digi-Key; Supplier Part Number 1: 311-1.2KARCT-ND; Tolerance: 5%; Package: 0805
R91 = RES_1kΩ_0805_1%_1: as R205 on sheet SH2 - 17V BUCK CONVERTER; Supplier 1: Digi-Key; Supplier Part Number 1: 311-1.00KCRCT-ND; Package: 0805; Mounting Type: SMD; LCSC Part #: C17513
R601 = RES_1kΩ_0603_5%: RES 1K OHM 5% 1/10W 0603; Manufacturer 1: Yageo; Manufacturer Part Number 1: RC0603JR-071KL; Supplier Part Number 1: 311-1.0KGRCT-ND; Supplier 1: Digi-Key; Mounting Type: SMD; Package: 0603
TP_17VEN = TESTPOINT_1MM_CIRCLE: TESTPOINT 1MM CIRCLE
U15 = BTS5014SDAAUMA1: IC PWR SWITCH N-CHAN 1:1 TO252-5; Manufacturer 1: Infineon Technologies; Package/Footprint: TO-252-5; Mounting Type: SMD; Manufacturer Part Number 1: BTS5014SDAAUMA1; Supplier 1: Digi-Key; Supplier Part Number 1: BTS5014SDAAUMA1CT-ND; Supplier 2: Mouser; Supplier Part Number 2: 726-BTS5014SDA

## Sheet SH7 - MICROCONTROLLER.SchDoc: Microcontroller
size B; Engineer: Farris Matar; Organization: UW Robotics; Address1: 200 University Avenue; Address2: Waterloo; Address3: Ontario; Address4: Canada N2L 3G6; DocumentNumber: 7; Revision: 3; SheetNumber: 7; SheetTotal: 9
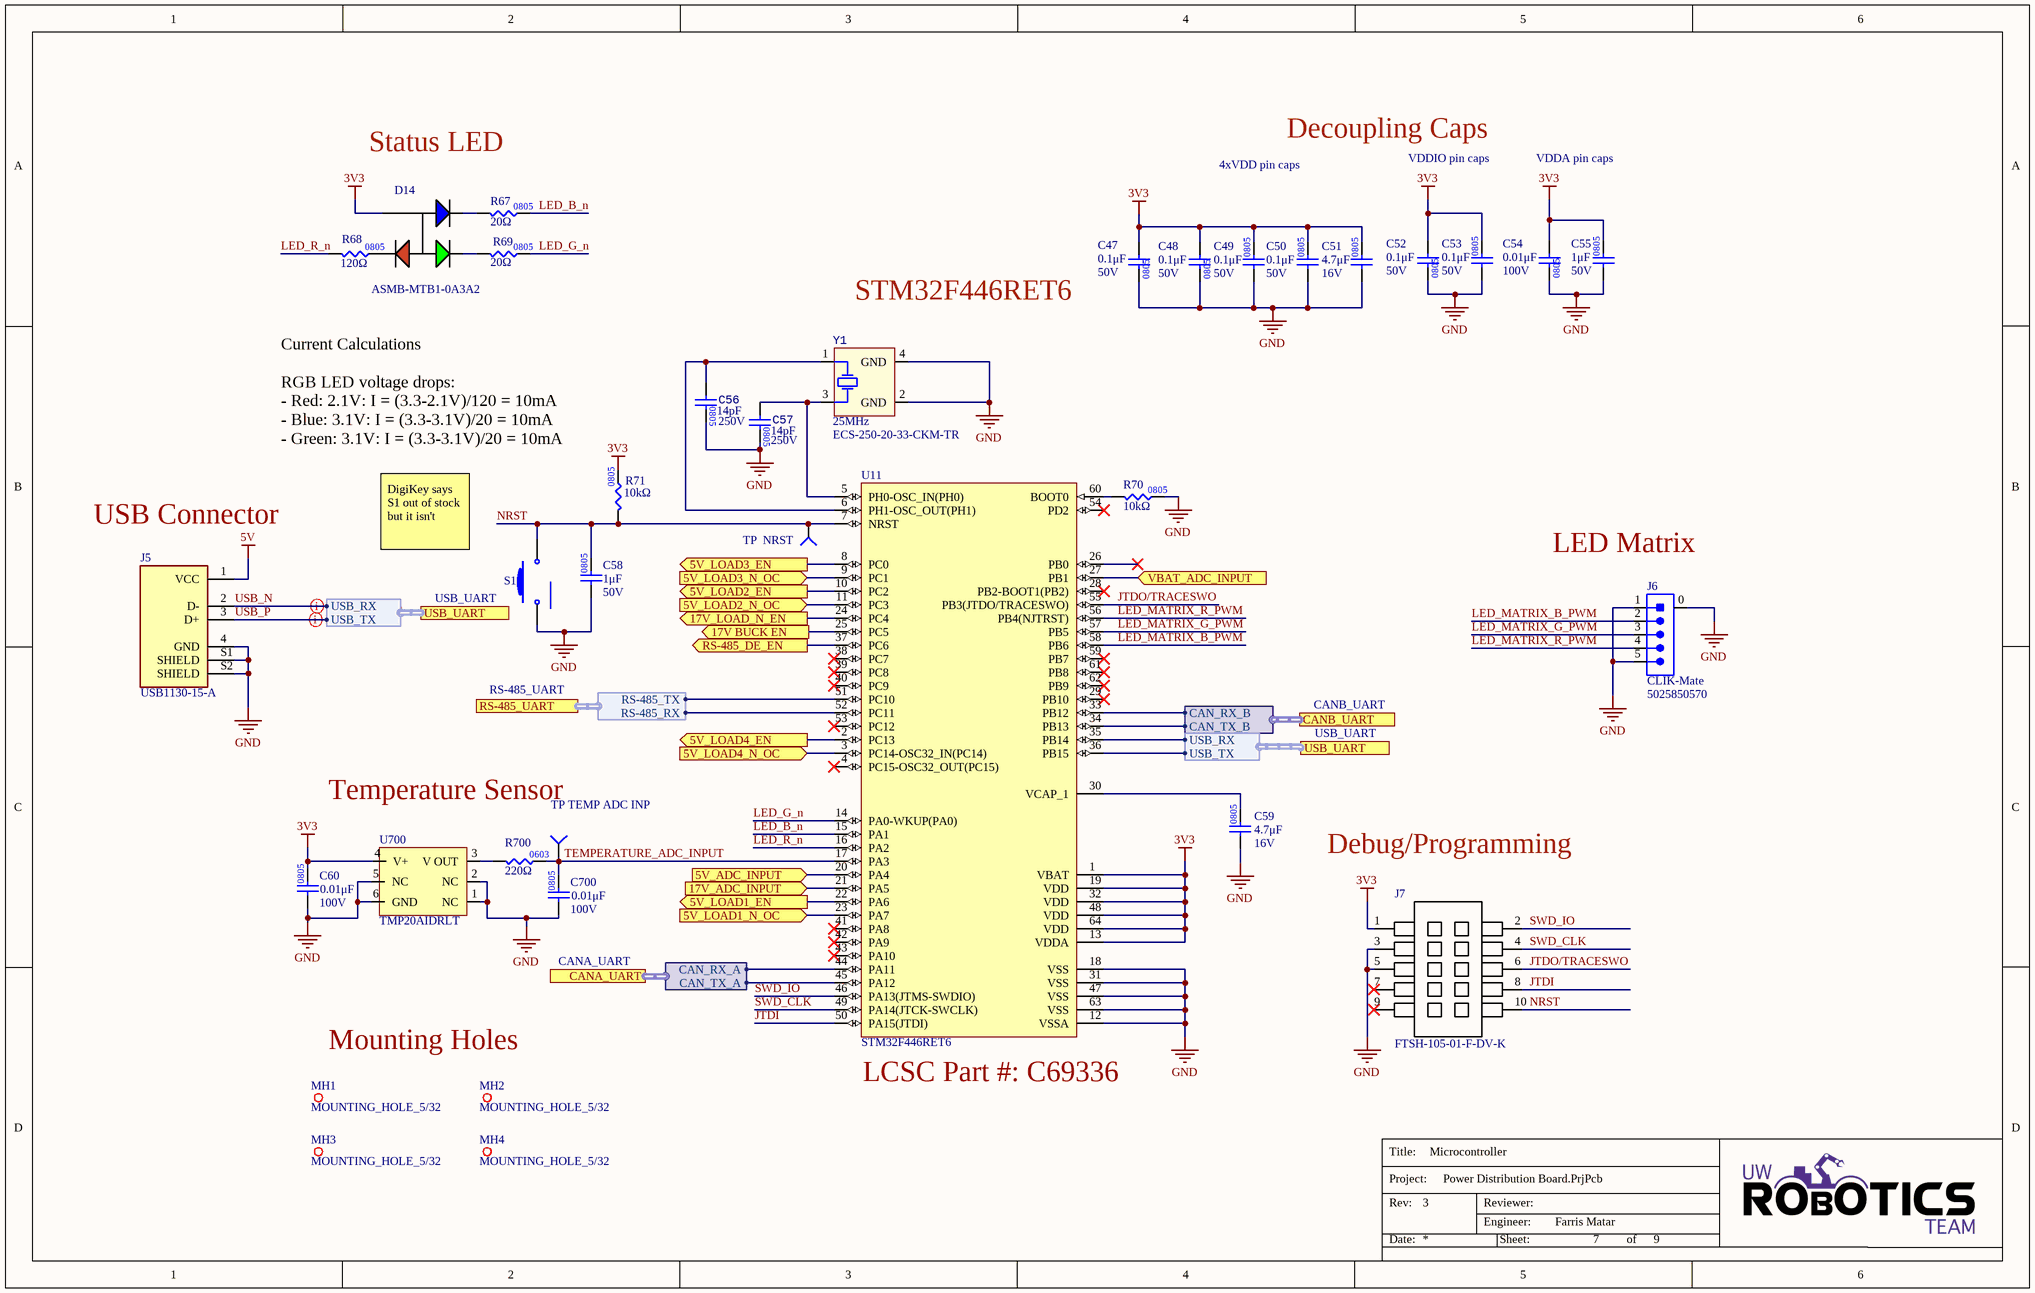
[diagram p6: SH7 - MICROCONTROLLER.SchDoc]

### Parts
C47  value 0.1μF  Voltage Rating: 50V  [CAP2012]  (hidden comment: CAP_0.1uF_50V_0805)
C48  value 0.1μF  Voltage Rating: 50V  [CAP2012]  (hidden comment: CAP_0.1uF_50V_0805)
C49  value 0.1μF  Voltage Rating: 50V  [CAP2012]  (hidden comment: CAP_0.1uF_50V_0805)
C50  value 0.1μF  Voltage Rating: 50V  [CAP2012]  (hidden comment: CAP_0.1uF_50V_0805)
C51  value 4.7μF  Voltage Rating: 16V  [CAP0805]  (hidden comment: CAP_4.7uF_16V_0805)
C52  value 0.1μF  Voltage Rating: 50V  [CAP2012]  (hidden comment: CAP_0.1uF_50V_0805)
C53  value 0.1μF  Voltage Rating: 50V  [CAP2012]  (hidden comment: CAP_0.1uF_50V_0805)
C54  value 0.01μF  Voltage Rating: 100V  [CAP0805]  (hidden comment: CAP_0.01uF_100V_0805)
C55  value 1μF  Voltage Rating: 50V  [CAP2012]  (hidden comment: CAP_1uF_50V_0805)
C56  value 14pF  Voltage Rating: 250V  [CAP0805]  (hidden comment: CAP_14pF_50V_0805)
C57  value 14pF  Voltage Rating: 250V  [CAP0805]  (hidden comment: CAP_14pF_50V_0805)
C58  value 1μF  Voltage Rating: 50V  [CAP2012]  (hidden comment: CAP_1uF_50V_0805)
C59  value 4.7μF  Voltage Rating: 16V  [CAP0805]  (hidden comment: CAP_4.7uF_16V_0805)
C60  value 0.01μF  Voltage Rating: 100V  [CAP0805]  (hidden comment: CAP_0.01uF_100V_0805)
C700  value 0.01μF  Voltage Rating: 100V  [CAP0805]  (hidden comment: CAP_0.01uF_100V_0805)
D14  Manufacturer Part Number 1: ASMB-MTB1-0A3A2  [LED_RGB]  (hidden comment: LED_RGB)
J5  Manufacturer Part Number 1: USB1130-15-A  [USB-A 2.0 Connector - 3d ver]  (hidden comment: USB-A 2.0 Connector)
J6  Family: CLIK-Mate  Manufacturer Part Number 1: 5025850570  [MOLEX-5025850570]  (hidden comment: CON_5M_SM_RA)
J7  Manufacturer Part Number 1: FTSH-105-01-F-DV-K  [FTSH-105-01-F-DV-K-P-TR]  (hidden comment: CON_PROGRAMMING)
MH1  MOUNTING_HOLE_5/32  [MOUNTING_HOLE_5/38]  (no BOM)
MH2  MOUNTING_HOLE_5/32  [MOUNTING_HOLE_5/38]  (no BOM)
MH3  MOUNTING_HOLE_5/32  [MOUNTING_HOLE_5/38]  (no BOM)
MH4  MOUNTING_HOLE_5/32  [MOUNTING_HOLE_5/38]  (no BOM)
R67  value 20Ω  [RES0805]  (hidden comment: RES_20Ω_0805_1%)
R68  value 120Ω  [RES0805]  (hidden comment: RES_120Ω_0805_1%)
R69  value 20Ω  [RES0805]  (hidden comment: RES_20Ω_0805_1%)
R70  value 10kΩ  [RES0805]  (hidden comment: RES_10kΩ_0805_5%)
R71  value 10kΩ  [RES0805]  (hidden comment: RES_10kΩ_0805_5%)
R700  value 220Ω  [RES0603]  (hidden comment: RES_220Ω_0603_5%)
S1  SW_PUSHBUTTON  [TACTILE_SWITCH_SMD]  (value not drawn)
TP_NRST  TESTPOINT_1MM_CIRCLE  [TESTPOINT_CIRCLE_1MM]  (value not drawn)  (no BOM)
TP_TEMP_ADC_INP  TESTPOINT_1MM_CIRCLE  [TESTPOINT_CIRCLE_1MM]  (value not drawn)  (no BOM)
U11  STM32F446RET6  [STM-LQFP64_L]
U700  Manufacturer Part Number 1: TMP20AIDRLT  [DRL6-M]  (hidden comment: IC_TEMP_SENSOR_Replaced)
Y1  Frequency: 25MHz  Manufacturer Part Number 1: ECS-250-20-33-CKM-TR  [XTAL_ECS-250-20-33-CKM-TR]  (hidden comment: CRYSTAL_25MHZ_20PF)

### Ports
5V_ADC_INPUT (in), 5V_LOAD1_EN (out), 5V_LOAD1_N_OC (in), 5V_LOAD2_EN (out), 5V_LOAD2_N_OC (in), 5V_LOAD3_EN (out), 5V_LOAD3_N_OC (in), 5V_LOAD4_EN (out), 5V_LOAD4_N_OC (in), 17V BUCK EN (out), 17V_ADC_INPUT (in), 17V_LOAD_N_EN (out), CANA_UART (harness CANA_UART), CANB_UART (harness CANB_UART), RS-485_DE_EN (out), RS-485_UART (harness RS-485_UART), USB_UART (harness USB_UART), VBAT_ADC_INPUT (in)

### Harnesses
CANA_UART: CAN_RX_A, CAN_TX_A
CANB_UART: CAN_RX_B, CAN_TX_B
RS-485_UART: RS-485_TX, RS-485_RX
USB_UART: USB_TX, USB_RX

### Nets
3V3: C47.2 C48.2 C49.2 C50.2 C51.2 C52.2 C53.2 C54.2 C55.2 C60.2 D14.4(COMMON_ANODE) J7.1 R71.2 U11.1(VBAT) U11.13(VDDA) U11.19(VDD) U11.32(VDD) U11.48(VDD) U11.64(VDD) U700.4(V+)
5V: J5.1(VCC)
GND: C47.1 C48.1 C49.1 C50.1 C51.1 C52.1 C53.1 C54.1 C55.1 C56.2 C57.2 C58.1 C59.1 C60.1 C700.1 J5.4(GND) J5.S1(SHIELD) J5.S2(SHIELD) J6.0 J6.1 J6.5 J7.3 J7.5 R70.2 S1.1 U11.12(VSSA) U11.18(VSS) U11.31(VSS) U11.47(VSS) U11.63(VSS) U700.1(NC) U700.2(NC) U700.5(NC) U700.6(GND) Y1.2(GND) Y1.4(GND)
JTDI: J7.8 U11.50(PA15(JTDI))
JTDO/TRACESWO: J7.6 U11.55(PB3(JTDO/TRACESWO))
LED_B_n: R67.2 U11.15(PA1)
LED_G_n: R69.2 U11.14(PA0-WKUP(PA0))
LED_MATRIX_B_PWM: J6.2 U11.58(PB6)
LED_MATRIX_G_PWM: J6.3 U11.57(PB5)
LED_MATRIX_R_PWM: J6.4 U11.56(PB4(NJTRST))
LED_R_n: R68.1 U11.16(PA2)
NRST: C58.2 J7.10 R71.1 S1.2 TP_NRST.1(=value) U11.7(NRST)
SWD_CLK: J7.4 U11.49(PA14(JTCK-SWCLK))
SWD_IO: J7.2 U11.46(PA13(JTMS-SWDIO))
TEMPERATURE_ADC_INPUT: C700.2 R700.2 TP_TEMP_ADC_INP.1(=value) U11.17(PA3)
USB_N: J5.2(D-) U11.35(PB14) ; port USB_UART.USB_RX
USB_P: J5.3(D+) U11.36(PB15) ; port USB_UART.USB_TX
NetC56_1: C56.1 U11.6(PH1-OSC_OUT(PH1)) Y1.1(HOT)
NetC57_1: C57.1 U11.5(PH0-OSC_IN(PH0)) Y1.3(HOT)
NetC59_2: C59.2 U11.30(VCAP_1)
NetD14_1: D14.1(CATHODE_(RED)) R68.2
NetD14_2: D14.2(CATHODE_(GREEN)) R69.1
NetD14_3: D14.3(CATHODE_(BLUE)) R67.1
NetD16_1: U11.20(PA4) ; port 5V_ADC_INPUT
NetD17_1: U11.21(PA5) ; port 17V_ADC_INPUT
NetD19_1: U11.27(PB1) ; port VBAT_ADC_INPUT
NetQ3_1: U11.24(PC4) ; port 17V_LOAD_N_EN
NetQ203_1: U11.25(PC5) ; port 17V BUCK EN
NetR70_1: R70.1 U11.60(BOOT0)
NetR700_1: R700.1 U700.3(V_OUT)
NetTP13_1: U11.52(PC11) ; port RS-485_UART.RS-485_RX
NetTP14_1: U11.51(PC10) ; port RS-485_UART.RS-485_TX
NetTP_5VL1_1: U11.22(PA6) ; port 5V_LOAD1_EN
NetTP_5VL2_1: U11.10(PC2) ; port 5V_LOAD2_EN
NetTP_5VL3_1: U11.8(PC0) ; port 5V_LOAD3_EN
NetTP_5VL4_1: U11.2(PC13) ; port 5V_LOAD4_EN
NetTP_RS-485_EN_1: U11.37(PC6) ; port RS-485_DE_EN
NetU11_3: U11.3(PC14-OSC32_IN(PC14)) ; port 5V_LOAD4_N_OC
NetU11_9: U11.9(PC1) ; port 5V_LOAD3_N_OC
NetU11_11: U11.11(PC3) ; port 5V_LOAD2_N_OC
NetU11_23: U11.23(PA7) ; port 5V_LOAD1_N_OC
NetU11_33: U11.33(PB12) ; port CANB_UART.CAN_RX_B
NetU11_34: U11.34(PB13) ; port CANB_UART.CAN_TX_B
NetU11_44: U11.44(PA11) ; port CANA_UART.CAN_RX_A
NetU11_45: U11.45(PA12) ; port CANA_UART.CAN_TX_A

Not connected (* = marked no-connect by the designer): J7 7* 9*; U11 4(PC15-OSC32_OUT(PC15))* 26(PB0)* 28(PB2-BOOT1(PB2))* 29(PB10)* 38(PC7)* 39(PC8)* 40(PC9)* 41(PA8)* 42(PA9)* 43(PA10)* 53(PC12)* 54(PD2)* 59(PB7)* 61(PB8)* 62(PB9)*

### Layout directives
differential pair: USB_N, USB_P

### Notes on the sheet
- Status LED
- 4xVDD pin caps
- Decoupling Caps
- VDDIO pin caps
- VDDA pin caps
- STM32F446RET6
- (near R71) Current Calculations
  RGB LED voltage drops:
  - Red: 2.1V: I = (3.3-2.1V)/120 = 10mA
  - Blue: 3.1V: I = (3.3-3.1V)/20 = 10mA
  - Green: 3.1V: I = (3.3-3.1V)/20 = 10mA
- (near J5) USB Connector
- DigiKey says S1 out of stock but it isn't
- (near J6) LED Matrix
- Temperature Sensor
- Debug/Programming
- Mounting Holes
- (near U11) LCSC Part #: C69336
- Title:
- Project:
- Date:
- Rev:
- Reviewer:
- Engineer:
- Sheet:
- of

### Library data of the parts
C47-C50 C52 C53 = CAP_0.1uF_50V_0805: as C312 on sheet SH3 - 5V BUCK CONVERTER; Supplier Part Number 1: 490-8049-1-ND; Supplier 1: Digi-Key; Dielectric: X7R; LCSC Part #: C49678; Mounting Type: SMD
C51 C59 = CAP_4.7uF_16V_0805: CAP CER 4.7UF 16V X5R 0805; Manufacturer Part Number 1: CL21A475KOFNNNE; Manufacturer 1: Samsung Electro-Mechanics; Supplier Part Number 1: 1276-1065-1-ND; Supplier 1: Digi-Key; Dielectric: X5R; LCSC Part #: C1779; Mounting Type: SMD; Package: 0805
C54 C60 C700 = CAP_0.01uF_100V_0805: CAP CER 0.01uF 100V X7R 0805; Manufacturer Part Number 1: 08051C103KAT2A; Manufacturer 1: AVX Corporation; Supplier Part Number 1: 478-1358-1-ND; Supplier 1: Digi-Key; Dielectric: X7R; LCSC Part #: C1710; Mounting Type: SMD; Package: 0805
C55 C58 = CAP_1uF_50V_0805: as C45 on sheet SH4 - 3.3V LINEAR REGULATOR; Supplier Part Number 1: 1276-6470-1-ND; Supplier 1: Digi-Key; LCSC Part #: C28323; Mounting Type: SMD; Package: 0805
C56 C57 = CAP_14pF_50V_0805: CERAMIC CAP MLCC HIGH-Q 125C; Manufacturer: Murata Electronics; Manufacturer Part Number: GQM2195C2E140JB12D; Mounting Type: SMD; Package: 0805; Supplier 1: Digi-Key; Supplier Part Number 1: 490-GQM2195C2E140JB12DCT-ND
D14 = LED_RGB: LED RGB DIFFUSED 4PLCC SMD; Manufacturer 1: Broadcom; Color: Blue,Green,Red; Lens Color: White; Viewing Angle: 115°; Lens Style: Round; Luminous Intensity: 350mcd; Dominant Wavelength: 470nm; Forward Voltage: 3.1V; Test Current: 20mA; Package/Footprint: 4-PLCC; Supplier 1: Digi-Key; Number of Pins: 4; Lens Transparency: Diffused; Supplier Part Number 1: 516-3280-1-ND; Mounting Type: SMD
J5 = USB-A 2.0 Connector: USB-A (USB TYPE-A) USB 2.0 Receptacle Connector 4 Position Through Hole, Right Angle; Manufacturer 1: GCT; Supplier 1: Digi-Key; Supplier Part Number 1: 2073-USB1130-15-ACT-ND
J6 = CON_5M_SM_RA: CONN HEADER SMD RIGHT ANGLE 1.5MM PITCH; Manufacturer 1: Molex; Current Rating: 2A; Supplier 1: Digi-Key; Supplier Part Number 1: WM14469CT-ND; Orientation: Right Angle; Mounting Type: SMD; Package/Footprint: SMD
J7 = CON_PROGRAMMING: CONN HEADER SMD 10POS 1.27MM; Manufacturer 1: Samtec; Supplier 1: Digi-Key; Pitch: 1.27mm; Supplier Part Number 1: SAM8796-ND; Mounting Type: SMD
R67 R69 = RES_20Ω_0805_1%: RES 20 OHM 1% 1/8W 0805; Manufacturer 1: Yageo; Manufacturer Part Number 1: RC0805FR-0720RL; Supplier Part Number 1: 311-20.0CRCT-ND; Supplier 1: Digi-Key; LCSC Part #: C17581; Mounting Type: SMD; Package: 0805
R68 = RES_120Ω_0805_1%: RES 120 OHM 1% 1/8W 0805; Manufacturer 1: Vishay; Manufacturer Part Number 1: CRCW0805120RFKEA; Package/Footprint: 0805; Supplier Part Number 1: 541-120CCT-ND; Supplier 1: Digi-Key; LCSC Part #: C17437; Mounting Type: SMD
R70 R71 = RES_10kΩ_0805_5%: as R93 on sheet SH1 - POWER; Supplier Part Number 1: P10KACT-ND; Supplier 1: Digi-Key; LCSC Part #: C17414; Mounting Type: SMD
R700 = RES_220Ω_0603_5%: RES 220 OHM 5% 1/10W 0603; Manufacturer 1: Yageo; Manufacturer Part Number 1: AC0603JR-07220RL; Package/Footprint: 0603; Supplier Part Number 1: YAG3652CT-ND; Supplier 1: Digi-Key
S1 = SW_PUSHBUTTON: SMT 3.0 X 2.6 MM TACT SWITCH WIT; Manufacturer Part Number 1: 435151014824; Manufacturer 1: Würth Elektronik; Supplier 1: Digi-Key; Supplier Part Number 1: 732-435151014824CT-ND
TP_NRST TP_TEMP_ADC_INP = TESTPOINT_1MM_CIRCLE: TESTPOINT 1MM CIRCLE
U11 = MCU_STM32F446RET6: ARM Cortex-M4 32-bit MCU+FPU, 512 KB Flash, 128 KB Internal RAM, 50 I/Os, 64-Pin LQFP, -40 to 85 degC, Tray; I/Os (High Current): 50; Supply Voltage(Vcc) min (V): 1.7; Operating Frequency(F) (Processor speed) (MHz): 180; D/A Converter: 2; Internal RAM Size (kB): 128; FLASH Size (Prog) (kB): 512; Core: ARM Cortex-M4; ComponentLink1Description: Manufacturer URL; Package Reference: 64-Pin Low-profile Quad Flat Package, Body 10 x 10 mm, Pitch 0.5 mm; ComponentLink2URL: http://www.st.com/st-web-ui/static/active/en/resource/technical/document/datasheet/DM00141306.pdf; Packing: Tray; DatasheetVersion: Rev. 6; ComponentLink1URL: http://www.st.com/; ComponentLink2Description: Datasheet; Package Description: LQFP64; Mounting Technology: Surface Mount; Supplier Part Number 1: 497-15376-ND; Supplier 1: Digi-Key
U700 = IC_TEMP_SENSOR_Replaced: SENSOR ANALOG -55C-130C 6SOT; Manufacturer 1: Texas Instruments; Package/Footprint: SOT-563; Mounting Type: SMD; Supplier 1: Digi-Key; Supplier Part Number 1: 296-25570-1-ND
Y1 = CRYSTAL_25MHZ_20PF: CRYSTAL 25.0000MHZ 20PF SMD; Manufacturer 1: ECS Inc.; Load Capacitance: 20pF; Supplier 1: Digi-Key; Supplier Part Number 1: XC1817CT-ND; Mounting Type: SMD; Package/Footprint: SMD